# Altium project rNET_POE_Sensor.PrjPcb
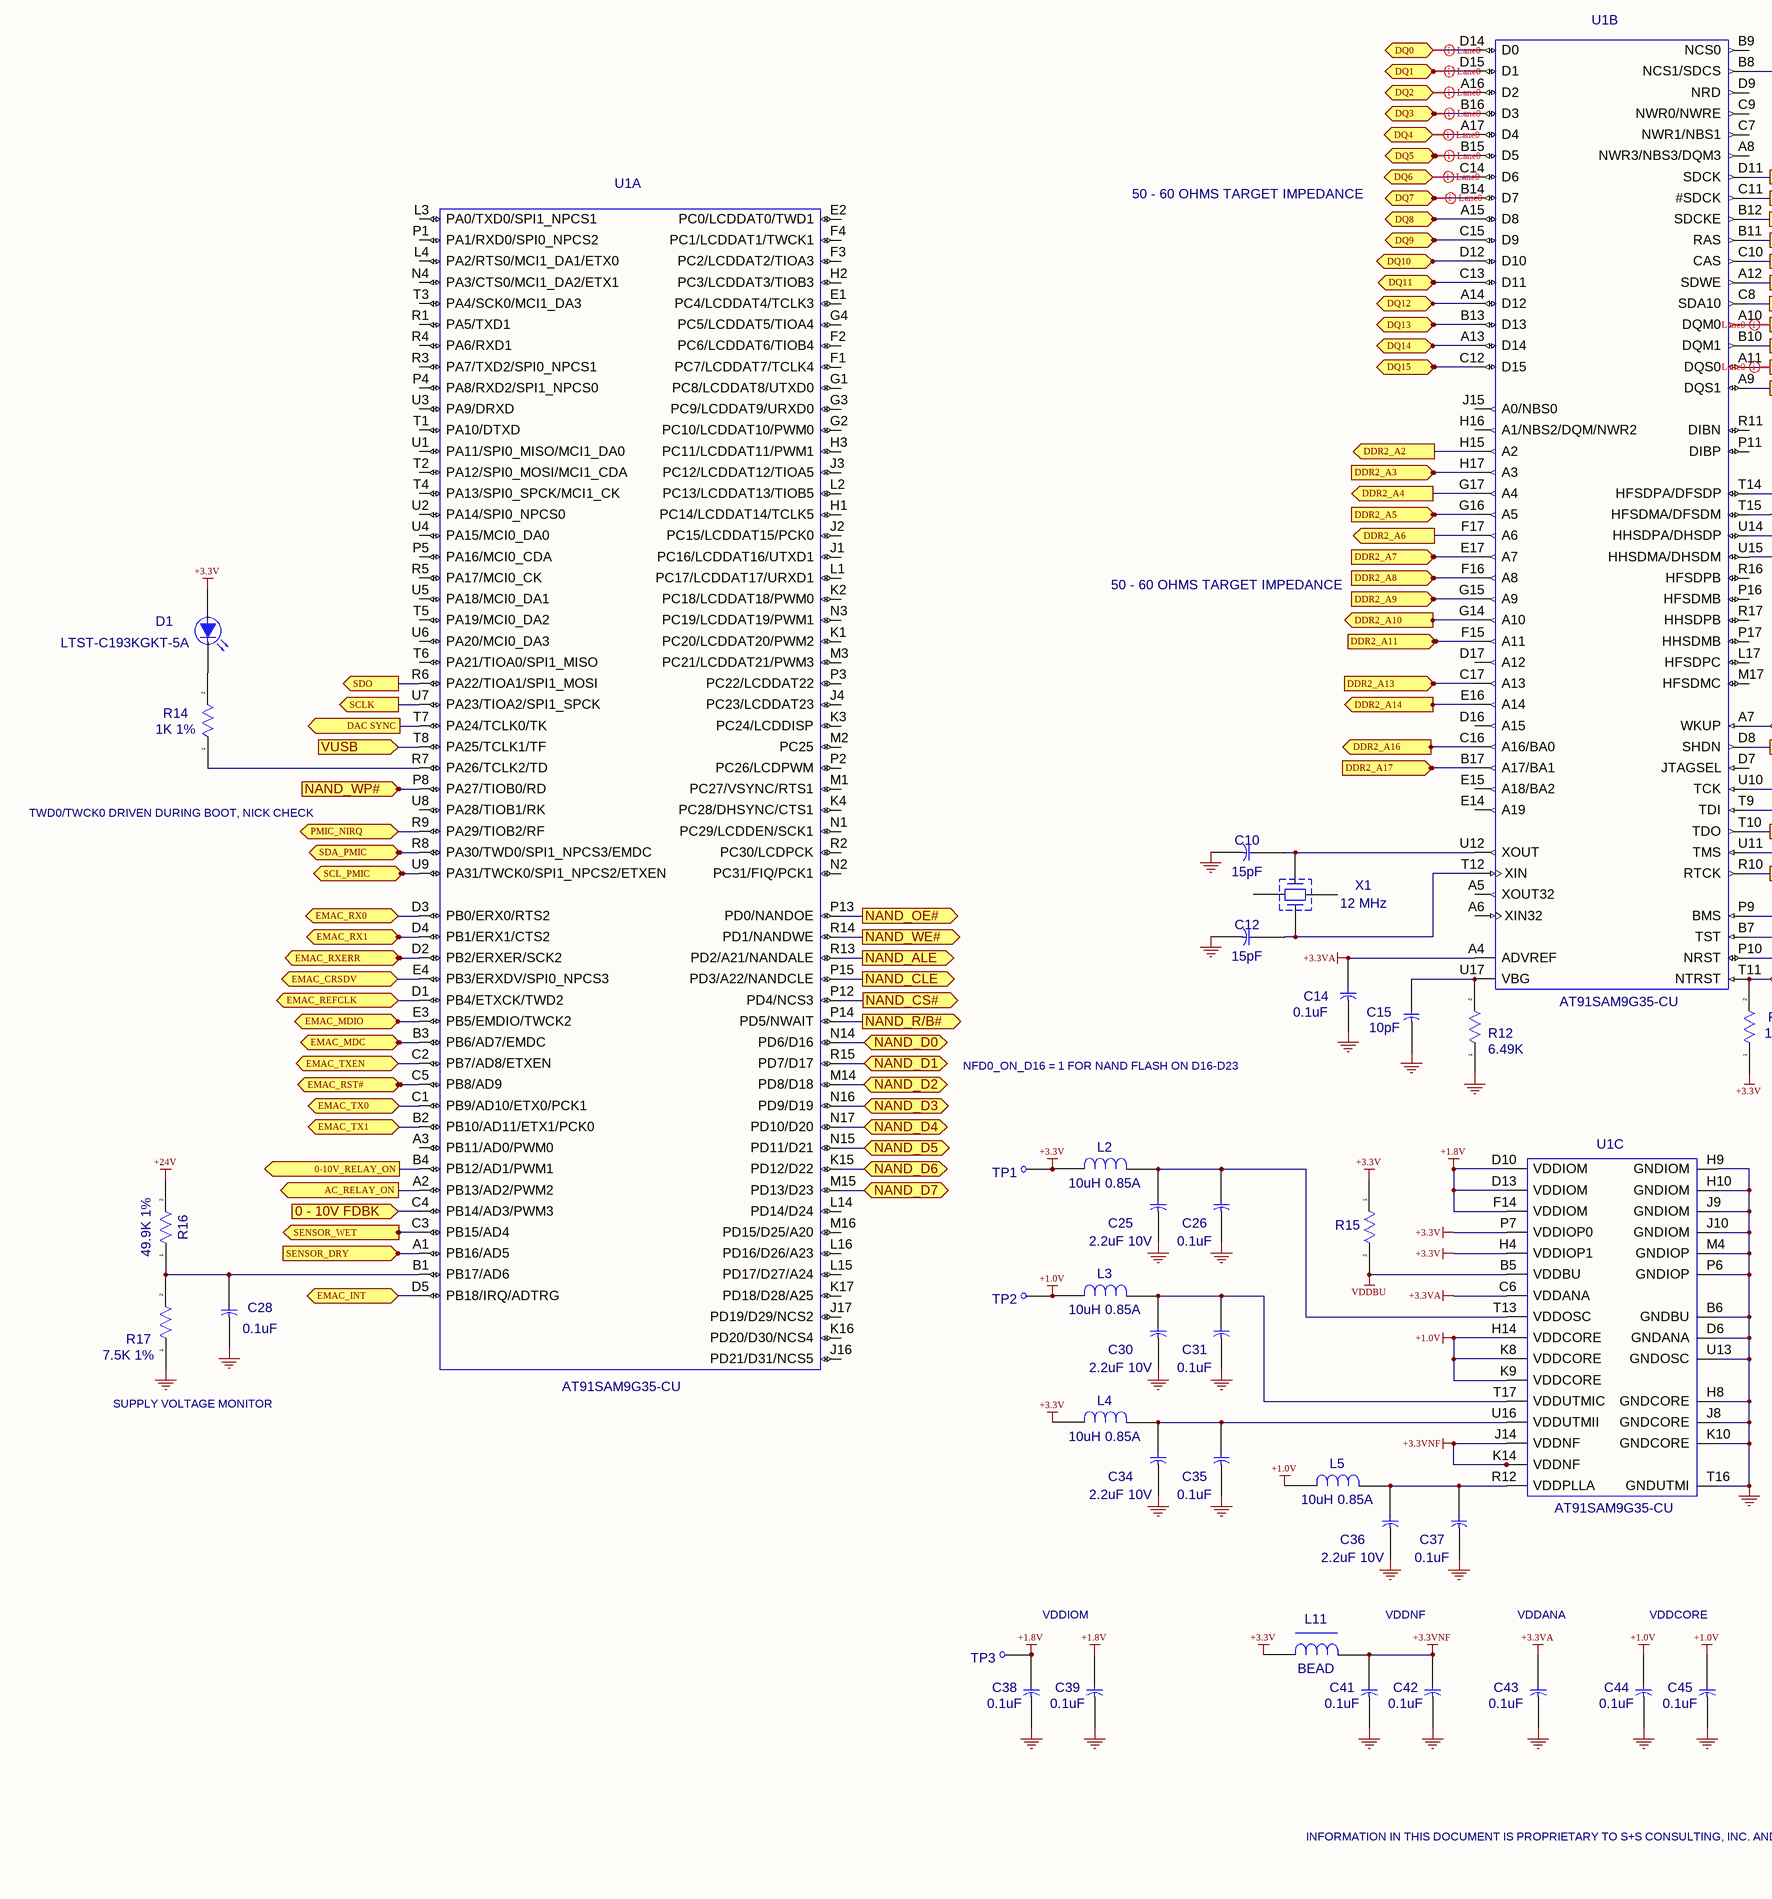
[diagram p0: rNET_POE_Sensor._Sheet1_RevA1.SchDoc, bottom left]
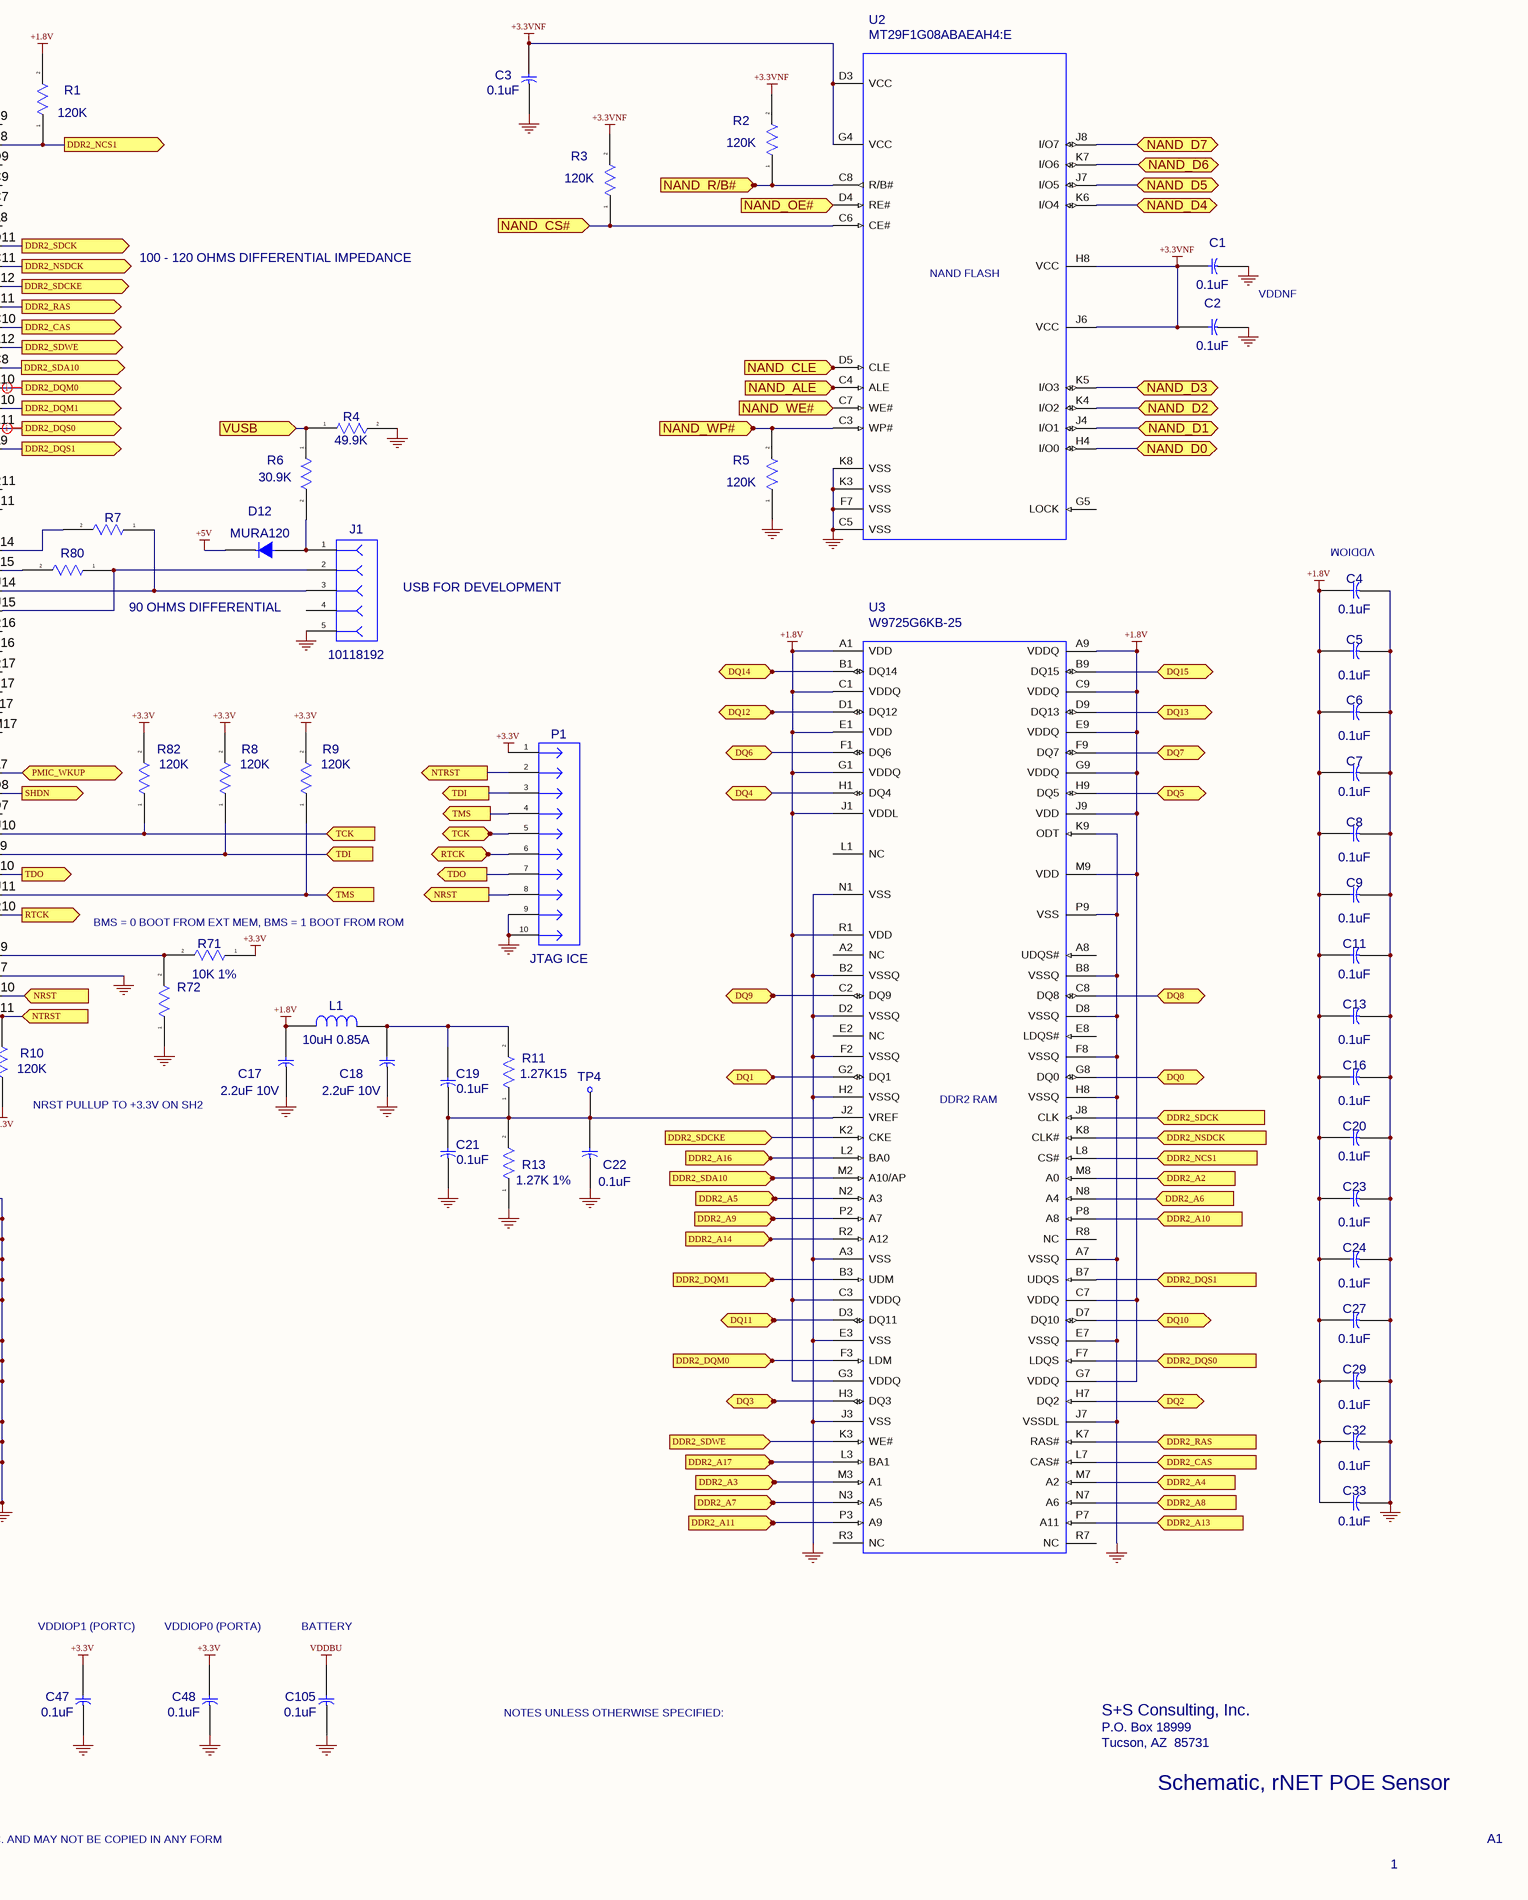
[diagram p1: rNET_POE_Sensor._Sheet1_RevA1.SchDoc, bottom right]
2 sheets, 269 parts. Net scope: global (net labels, ports and power ports of the same name join across sheets).
Board file: rNET_POE_Sensor_RevA1.PCBDOC
Sheets:
  rNET_POE_Sensor._Sheet1_RevA1.SchDoc
  rNET_POE_Sensor._Sheet2_RevA1.SchDoc

## Sheet rNET_POE_Sensor._Sheet1_RevA1.SchDoc: Sentinel Radio
size D; ApprovedBy: S. Fister; CompanyName: ECO Wireless; DrawnBy: SRF; Organization: Sentinel System, LLC; Address1: P.O. Box 18999; Address2: Tucson, AZ; Address3: 85731; Revision: X1; SheetNumber: 1; PageSetup: Record=PageOptions|CenterHorizontal=True|CenterVertical=True|PrintScale=0.52|XCorrection=1.00|YCorrection=1.00|PrintKind=0|BorderSize=5000000|LeftOffset=275|BottomOffset=0|Orientation=2|PaperLength=4318|PaperWidth=2794|Scale=100|PaperSource=7|PrintQuality=-3|MediaType=1|DitherType=10|PrintScaleMode=1|PaperKind=102 x 152 mm (4 x 6 in)|PaperIndex=158; ModifiedDate: Last Modified On

### Parts
C1  0.1uF  [0402NOM]
C2  0.1uF  [0402NOM]
C3  0.1uF  [0402NOM]
C4  0.1uF  [0402NOM]
C5  0.1uF  [0402NOM]
C6  0.1uF  [0402NOM]
C7  0.1uF  [0402NOM]
C8  0.1uF  [0402NOM]
C9  0.1uF  [0402NOM]
C10  15pF  [0402NOM]
C11  0.1uF  [0402NOM]
C12  15pF  [0402NOM]
C13  0.1uF  [0402NOM]
C14  0.1uF  [0402NOM]
C15  10pF  [0402NOM]
C16  0.1uF  [0402NOM]
C17  2.2uF 10V  [0402NOM]
C18  2.2uF 10V  [0402NOM]
C19  0.1uF  [0402NOM]
C20  0.1uF  [0402NOM]
C21  0.1uF  [0402NOM]
C22  0.1uF  [0402NOM]
C23  0.1uF  [0402NOM]
C24  0.1uF  [0402NOM]
C25  2.2uF 10V  [0402NOM]
C26  0.1uF  [0402NOM]
C27  0.1uF  [0402NOM]
C28  0.1uF  [0402NOM]
C29  0.1uF  [0402NOM]
C30  2.2uF 10V  [0402NOM]
C31  0.1uF  [0402NOM]
C32  0.1uF  [0402NOM]
C33  0.1uF  [0402NOM]
C34  2.2uF 10V  [0402NOM]
C35  0.1uF  [0402NOM]
C36  2.2uF 10V  [0402NOM]
C37  0.1uF  [0402NOM]
C38  0.1uF  [0402NOM]
C39  0.1uF  [0402NOM]
C41  0.1uF  [0402NOM]
C42  0.1uF  [0402NOM]
C43  0.1uF  [0402NOM]
C44  0.1uF  [0402NOM]
C45  0.1uF  [0402NOM]
C47  0.1uF  [0402NOM]
C48  0.1uF  [0402NOM]
C105  0.1uF  [0402NOM]
D1  LTST-C193KGKT-5A  [0603_POL]
D12  MURA120  [SMAPWR]
J1  10118192  [USB_MICROB_AMPHENOL_10118192-0001LF]
L1  10uH 0.85A  [1008]
L2  10uH 0.85A  [1008]
L3  10uH 0.85A  [1008]
L4  10uH 0.85A  [1008]
L5  10uH 0.85A  [1008]
L11  BEAD  [0402NOM]
P1  JTAG ICE  [HEADER2X5D50]
R1  120K  [0402NOM]
R2  120K  [0402NOM]
R3  120K  [0402NOM]
R4  49.9K  [0402NOM]
R5  120K  [0402NOM]
R6  30.9K  [0402NOM]
R7  39  [0402NOM]  (value not drawn)
R8  120K  [0402NOM]
R9  120K  [0402NOM]
R10  120K  [0402NOM]
R11  1.27K15  [0402NOM]
R12  6.49K  [0402NOM]
R13  1.27K 1%  [0402NOM]
R14  1K 1%  [0402NOM]
R15  0  [0402NOM]  (value not drawn)
R16  49.9K 1%  [0402NOM]
R17  7.5K 1%  [0402NOM]
R71  10K 1%  [0402NOM]
R72  49.9  [0402NOM]  (value not drawn)
R80  39  [0402NOM]  (value not drawn)
R82  120K  [0402NOM]
TP1  +3.3V  [TESTPOINTTOPD25]  (value not drawn)
TP2  +1.0V  [TESTPOINTTOPD25]  (value not drawn)
TP3  +1.8V  [TESTPOINTTOPD25]  (value not drawn)
TP4  VREF  [TESTPOINTTOPD25]  (value not drawn)
U1  AT91SAM9G35-CU  [BGA217_17x17]  (parts A,B,C of 3)
U2  MT29F1G08ABAEAH4:E  [VFBGA63]
U3  W9725G6KB-25  [WBGA84]
X1  12 MHz  [XTALABMM2]

### Ports
0 - 10V FDBK (in), 0-10V_RELAY_ON (out), AC_RELAY_ON (out), DAC SYNC (out), DDR2_A2 (in), DDR2_A2 (out), DDR2_A3 (in), DDR2_A3 (out), DDR2_A4 (in), DDR2_A4 (out), DDR2_A5 (in), DDR2_A5 (out), DDR2_A6 (in), DDR2_A6 (out), DDR2_A7 (in), DDR2_A7 (out), DDR2_A8 (in), DDR2_A8 (out), DDR2_A9 (in), DDR2_A9 (out), DDR2_A10 (in), DDR2_A10 (out), DDR2_A11 (in), DDR2_A11 (out), DDR2_A13 (in), DDR2_A13 (out), DDR2_A14 (in), DDR2_A14 (out), DDR2_A16 (in), DDR2_A16 (out), DDR2_A17 (in), DDR2_A17 (out), DDR2_CAS (in), DDR2_CAS (out), DDR2_DQM0 (in), DDR2_DQM0 (out), DDR2_DQM1 (in), DDR2_DQM1 (out), DDR2_DQS0 (in), DDR2_DQS0 (out), DDR2_DQS1 (in), DDR2_DQS1 (out), DDR2_NCS1 (in), DDR2_NCS1 (out), DDR2_NSDCK (in), DDR2_NSDCK (out), DDR2_RAS (in), DDR2_RAS (out), DDR2_SDA10 (in), DDR2_SDA10 (out), DDR2_SDCK (in), DDR2_SDCK (out), DDR2_SDCKE (in), DDR2_SDCKE (out), DDR2_SDWE (in), DDR2_SDWE (out), DQ0 (bidir), DQ1 (bidir), DQ2 (bidir), DQ3 (bidir), DQ4 (bidir), DQ5 (bidir), DQ6 (bidir), DQ7 (bidir), DQ8 (bidir), DQ9 (bidir), DQ10 (bidir), DQ11 (bidir), DQ12 (bidir), DQ13 (bidir), DQ14 (bidir), DQ15 (bidir), EMAC_CRSDV (bidir), EMAC_INT (bidir), EMAC_MDC (bidir), EMAC_MDIO (bidir), EMAC_REFCLK (bidir), EMAC_RST# (bidir), EMAC_RX0 (bidir), EMAC_RX1 (bidir), EMAC_RXERR (bidir), EMAC_TX0 (bidir), EMAC_TX1 (bidir), EMAC_TXEN (bidir), NAND_ALE (in), NAND_ALE (out), NAND_CLE (in), NAND_CLE (out), NAND_CS# (in), NAND_CS# (out), NAND_D0 (bidir), NAND_D1 (bidir), NAND_D2 (bidir), NAND_D3 (bidir), NAND_D4 (bidir), NAND_D5 (bidir), NAND_D6 (bidir), NAND_D7 (bidir), NAND_OE# (in), NAND_OE# (out), NAND_R/B# (in), NAND_R/B# (out), NAND_WE# (in), NAND_WE# (out), NAND_WP# (in), NAND_WP# (out), NRST (in), NRST (out), NTRST (in), NTRST (out), PMIC_NIRQ (bidir), PMIC_WKUP (bidir), RTCK (in), RTCK (out), SCL_PMIC (bidir), SCLK (out), SDA_PMIC (bidir), SDO (out), SENSOR_DRY (in), SENSOR_WET (in), SHDN (out), TCK (in), TCK (out), TDI (in), TDI (out), TDO (out), TMS (in), TMS (out), VUSB

### Nets
+1.0V: C44.2 C45.2 L3.2 L5.2 TP2.1 U1.H14(VDDCORE) U1.K8(VDDCORE) U1.K9(VDDCORE)
+1.8V: C4.2 C5.2 C6.2 C7.2 C8.2 C9.2 C11.2 C13.2 C16.2 C17.2 C20.2 C23.2 C24.2 C27.2 C29.2 C32.2 C33.2 C38.2 C39.2 L1.2 R1.2 TP3.1 U1.D10(VDDIOM) U1.D13(VDDIOM) U1.F14(VDDIOM) U3.A1(VDD) U3.A9(VDDQ) U3.C1(VDDQ) U3.C3(VDDQ) U3.C7(VDDQ) U3.C9(VDDQ) U3.E1(VDD) U3.E9(VDDQ) U3.G1(VDDQ) U3.G3(VDDQ) U3.G7(VDDQ) U3.G9(VDDQ) U3.J1(VDDL) U3.J9(VDD) U3.M9(VDD) U3.R1(VDD)
+3.3V: C47.2 C48.2 D1.2(A) L2.2 L4.2 L11.2 P1.1 R8.2 R9.2 R10.1 R15.1 R71.1 R82.2 TP1.1 U1.H4(VDDIOP1) U1.P7(VDDIOP0)
+3.3VA: C14.2 C43.2 U1.A4(ADVREF) U1.C6(VDDANA)
+3.3VNF: C1.2 C2.2 C3.2 C41.2 C42.2 L11.1 R2.2 R3.2 U1.J14(VDDNF) U1.K14(VDDNF) U2.D3(VCC) U2.G4(VCC) U2.H8(VCC) U2.J6(VCC)
+5V: D12.2(C)
+24V: R16.2
GND: C1.1 C2.1 C3.1 C4.1 C5.1 C6.1 C7.1 C8.1 C9.1 C10.1 C11.1 C12.1 C13.1 C14.1 C15.1 C16.1 C17.1 C18.1 C20.1 C21.1 C22.1 C23.1 C24.1 C25.1 C26.1 C27.1 C28.1 C29.1 C30.1 C31.1 C32.1 C33.1 C34.1 C35.1 C36.1 C37.1 C38.1 C39.1 C41.1 C42.1 C43.1 C44.1 C45.1 C47.1 C48.1 C105.1 J1.5 P1.9 P1.10 R4.2 R5.1 R12.1 R13.1 R17.1 R72.1 U1.B6(GNDBU) U1.B7(TST) U1.D6(GNDANA) U1.H8(GNDCORE) U1.H9(GNDIOM) U1.H10(GNDIOM) U1.J8(GNDCORE) U1.J9(GNDIOM) U1.J10(GNDIOM) U1.K10(GNDCORE) U1.M4(GNDIOP) U1.P6(GNDIOP) U1.T16(GNDUTMI) U1.U13(GNDOSC) U2.C5(VSS) U2.F7(VSS) U2.K3(VSS) U2.K8(VSS) U3.A3(VSS) U3.A7(VSSQ) U3.B2(VSSQ) U3.B8(VSSQ) U3.D2(VSSQ) U3.D8(VSSQ) U3.E3(VSS) U3.E7(VSSQ) U3.F2(VSSQ) U3.F8(VSSQ) U3.H2(VSSQ) U3.H8(VSSQ) U3.J3(VSS) U3.J7(VSSDL) U3.K9(ODT) U3.N1(VSS) U3.P9(VSS)
VDDBU: C105.2 R15.2 U1.B5(VDDBU)
0 - 10V FDBK: U1.C4(PB14/AD3/PWM3) ; port 0 - 10V FDBK
0-10V_RELAY_ON: U1.B4(PB12/AD1/PWM1) ; port 0-10V_RELAY_ON
AC_RELAY_ON: U1.A2(PB13/AD2/PWM2) ; port AC_RELAY_ON
DAC SYNC: U1.T7(PA24/TCLK0/TK) ; port DAC SYNC
DDR2_A2: U1.H15(A2) U3.M8(A0) ; port DDR2_A2
DDR2_A3: U1.H17(A3) U3.M3(A1) ; port DDR2_A3
DDR2_A4: U1.G17(A4) U3.M7(A2) ; port DDR2_A4
DDR2_A5: U1.G16(A5) U3.N2(A3) ; port DDR2_A5
DDR2_A6: U1.F17(A6) U3.N8(A4) ; port DDR2_A6
DDR2_A7: U1.E17(A7) U3.N3(A5) ; port DDR2_A7
DDR2_A8: U1.F16(A8) U3.N7(A6) ; port DDR2_A8
DDR2_A9: U1.G15(A9) U3.P2(A7) ; port DDR2_A9
DDR2_A10: U1.G14(A10) U3.P8(A8) ; port DDR2_A10
DDR2_A11: U1.F15(A11) U3.P3(A9) ; port DDR2_A11
DDR2_A13: U1.C17(A13) U3.P7(A11) ; port DDR2_A13
DDR2_A14: U1.E16(A14) U3.R2(A12) ; port DDR2_A14
DDR2_A16: U1.C16(A16/BA0) U3.L2(BA0) ; port DDR2_A16
DDR2_A17: U1.B17(A17/BA1) U3.L3(BA1) ; port DDR2_A17
DDR2_CAS: U1.C10(CAS) U3.L7(CAS#) ; port DDR2_CAS
DDR2_DQM0: U1.A10(DQM0) U3.F3(LDM) ; port DDR2_DQM0
DDR2_DQM1: U1.B10(DQM1) U3.B3(UDM) ; port DDR2_DQM1
DDR2_DQS0: U1.A11(DQS0) U3.F7(LDQS) ; port DDR2_DQS0
DDR2_DQS1: U1.A9(DQS1) U3.B7(UDQS) ; port DDR2_DQS1
DDR2_NCS1: R1.1 U1.B8(NCS1/SDCS) U3.L8(CS#) ; port DDR2_NCS1
DDR2_NSDCK: U1.C11(#SDCK) U3.K8(CLK#) ; port DDR2_NSDCK
DDR2_RAS: U1.B11(RAS) U3.K7(RAS#) ; port DDR2_RAS
DDR2_SDA10: U1.C8(SDA10) U3.M2(A10/AP) ; port DDR2_SDA10
DDR2_SDCK: U1.D11(SDCK) U3.J8(CLK) ; port DDR2_SDCK
DDR2_SDCKE: U1.B12(SDCKE) U3.K2(CKE) ; port DDR2_SDCKE
DDR2_SDWE: U1.A12(SDWE) U3.K3(WE#) ; port DDR2_SDWE
DQ0: U1.D14(D0) U3.G8(DQ0) ; port DQ0
DQ1: U1.D15(D1) U3.G2(DQ1) ; port DQ1
DQ2: U1.A16(D2) U3.H7(DQ2) ; port DQ2
DQ3: U1.B16(D3) U3.H3(DQ3) ; port DQ3
DQ4: U1.A17(D4) U3.H1(DQ4) ; port DQ4
DQ5: U1.B15(D5) U3.H9(DQ5) ; port DQ5
DQ6: U1.C14(D6) U3.F1(DQ6) ; port DQ6
DQ7: U1.B14(D7) U3.F9(DQ7) ; port DQ7
DQ8: U1.A15(D8) U3.C8(DQ8) ; port DQ8
DQ9: U1.C15(D9) U3.C2(DQ9) ; port DQ9
DQ10: U1.D12(D10) U3.D7(DQ10) ; port DQ10
DQ11: U1.C13(D11) U3.D3(DQ11) ; port DQ11
DQ12: U1.A14(D12) U3.D1(DQ12) ; port DQ12
DQ13: U1.B13(D13) U3.D9(DQ13) ; port DQ13
DQ14: U1.A13(D14) U3.B1(DQ14) ; port DQ14
DQ15: U1.C12(D15) U3.B9(DQ15) ; port DQ15
EMAC_CRSDV: U1.E4(PB3/ERXDV/SPI0_NPCS3) ; port EMAC_CRSDV
EMAC_INT: U1.D5(PB18/IRQ/ADTRG) ; port EMAC_INT
EMAC_MDC: U1.B3(PB6/AD7/EMDC) ; port EMAC_MDC
EMAC_MDIO: U1.E3(PB5/EMDIO/TWCK2) ; port EMAC_MDIO
EMAC_REFCLK: U1.D1(PB4/ETXCK/TWD2) ; port EMAC_REFCLK
EMAC_RST#: U1.C5(PB8/AD9) ; port EMAC_RST#
EMAC_RX0: U1.D3(PB0/ERX0/RTS2) ; port EMAC_RX0
EMAC_RX1: U1.D4(PB1/ERX1/CTS2) ; port EMAC_RX1
EMAC_RXERR: U1.D2(PB2/ERXER/SCK2) ; port EMAC_RXERR
EMAC_TX0: U1.C1(PB9/AD10/ETX0/PCK1) ; port EMAC_TX0
EMAC_TX1: U1.B2(PB10/AD11/ETX1/PCK0) ; port EMAC_TX1
EMAC_TXEN: U1.C2(PB7/AD8/ETXEN) ; port EMAC_TXEN
NAND_ALE: U1.R13(PD2/A21/NANDALE) U2.C4(ALE) ; port NAND_ALE
NAND_CLE: U1.P15(PD3/A22/NANDCLE) U2.D5(CLE) ; port NAND_CLE
NAND_CS#: R3.1 U1.P12(PD4/NCS3) U2.C6(CE#) ; port NAND_CS#
NAND_D0: U1.N14(PD6/D16) U2.H4(I/O0) ; port NAND_D0
NAND_D1: U1.R15(PD7/D17) U2.J4(I/O1) ; port NAND_D1
NAND_D2: U1.M14(PD8/D18) U2.K4(I/O2) ; port NAND_D2
NAND_D3: U1.N16(PD9/D19) U2.K5(I/O3) ; port NAND_D3
NAND_D4: U1.N17(PD10/D20) U2.K6(I/O4) ; port NAND_D4
NAND_D5: U1.N15(PD11/D21) U2.J7(I/O5) ; port NAND_D5
NAND_D6: U1.K15(PD12/D22) U2.K7(I/O6) ; port NAND_D6
NAND_D7: U1.M15(PD13/D23) U2.J8(I/O7) ; port NAND_D7
NAND_OE#: U1.P13(PD0/NANDOE) U2.D4(RE#) ; port NAND_OE#
NAND_R/B#: R2.1 U1.P14(PD5/NWAIT) U2.C8(R/B#) ; port NAND_R/B#
NAND_WE#: U1.R14(PD1/NANDWE) U2.C7(WE#) ; port NAND_WE#
NAND_WP#: R5.2 U1.P8(PA27/TIOB0/RD) U2.C3(WP#) ; port NAND_WP#
NRST: P1.8 U1.P10(NRST) ; port NRST
NTRST: P1.2 R10.2 U1.T11(NTRST) ; port NTRST
PMIC_NIRQ: U1.R9(PA29/TIOB2/RF) ; port PMIC_NIRQ
PMIC_WKUP: U1.A7(WKUP) ; port PMIC_WKUP
RTCK: P1.6 U1.R10(RTCK) ; port RTCK
SCL_PMIC: U1.U9(PA31/TWCK0/SPI1_NPCS2/ETXEN) ; port SCL_PMIC
SCLK: U1.U7(PA23/TIOA2/SPI1_SPCK) ; port SCLK
SDA_PMIC: U1.R8(PA30/TWD0/SPI1_NPCS3/EMDC) ; port SDA_PMIC
SDO: U1.R6(PA22/TIOA1/SPI1_MOSI) ; port SDO
SENSOR_DRY: U1.A1(PB16/AD5) ; port SENSOR_DRY
SENSOR_WET: U1.C3(PB15/AD4) ; port SENSOR_WET
SHDN: U1.D8(SHDN) ; port SHDN
TCK: P1.5 R82.1 U1.U10(TCK) ; port TCK
TDI: P1.3 R8.1 U1.T9(TDI) ; port TDI
TDO: P1.7 U1.T10(TDO) ; port TDO
TMS: P1.4 R9.1 U1.U11(TMS) ; port TMS
VUSB: R4.1 R6.1 U1.T8(PA25/TCLK1/TF) ; port VUSB
NetC10_2: C10.2 U1.U12(XOUT) X1.1
NetC12_2: C12.2 U1.T12(XIN) X1.3
NetC15_2: C15.2 R12.2 U1.U17(VBG)
NetC18_2: C18.2 C19.2 L1.1 R11.2
NetC19_1: C19.1 C21.2 C22.2 R11.1 R13.2 TP4.1 U3.J2(VREF)
NetC25_2: C25.2 C26.2 L2.1 U1.T13(VDDOSC)
NetC28_2: C28.2 R16.1 R17.2 U1.B1(PB17/AD6)
NetC30_2: C30.2 C31.2 L3.1 U1.T17(VDDUTMIC)
NetC34_2: C34.2 C35.2 L4.1 U1.U16(VDDUTMII)
NetC36_2: C36.2 C37.2 L5.1 U1.R12(VDDPLLA)
NetD1_1: D1.1(C) R14.2
NetD12_1: D12.1(A) J1.1 R6.2
NetJ1_2: J1.2 R80.1 U1.U15(HHSDMA/DHSDM)
NetJ1_3: J1.3 R7.1 U1.U14(HHSDPA/DHSDP)
NetR7_2: R7.2 U1.T14(HFSDPA/DFSDP)
NetR14_1: R14.1 U1.R7(PA26/TCLK2/TD)
NetR71_2: R71.2 R72.2 U1.P9(BMS)
NetR80_2: R80.2 U1.T15(HFSDMA/DFSDM)

Not connected (* = marked no-connect by the designer): J1 4 9 10 11 12; U1 A3(PB11/AD0/PWM0) A5(XOUT32) A6(XIN32) A8(NWR3/NBS3/DQM3) B9(NCS0) C7(NWR1/NBS1) C9(NWR0/NWRE) D7(JTAGSEL) D9(NRD) D16(A15) D17(A12) E1(PC4/LCDDAT4/TCLK3) E2(PC0/LCDDAT0/TWD1) E14(A19) E15(A18/BA2) F1(PC7/LCDDAT7/TCLK4) F2(PC6/LCDDAT6/TIOB4) F3(PC2/LCDDAT2/TIOA3) F4(PC1/LCDDAT1/TWCK1) G1(PC8/LCDDAT8/UTXD0) G2(PC10/LCDDAT10/PWM0) G3(PC9/LCDDAT9/URXD0) G4(PC5/LCDDAT5/TIOA4) H1(PC14/LCDDAT14/TCLK5) H2(PC3/LCDDAT3/TIOB3) H3(PC11/LCDDAT11/PWM1) H16(A1/NBS2/DQM/NWR2) J1(PC16/LCDDAT16/UTXD1) J2(PC15/LCDDAT15/PCK0) J3(PC12/LCDDAT12/TIOA5) J4(PC23/LCDDAT23) J15(A0/NBS0) J16(PD21/D31/NCS5) J17(PD19/D29/NCS2) K1(PC20/LCDDAT20/PWM2) K2(PC18/LCDDAT18/PWM0) K3(PC24/LCDDISP) K4(PC28/DHSYNC/CTS1) K16(PD20/D30/NCS4) K17(PD18/D28/A25) L1(PC17/LCDDAT17/URXD1) L2(PC13/LCDDAT13/TIOB5) L3(PA0/TXD0/SPI1_NPCS1) L4(PA2/RTS0/MCI1_DA1/ETX0) L14(PD14/D24) L15(PD17/D27/A24) L16(PD16/D26/A23) L17(HFSDPC) M1(PC27/VSYNC/RTS1) M2(PC25) M3(PC21/LCDDAT21/PWM3) M16(PD15/D25/A20) M17(HFSDMC) N1(PC29/LCDDEN/SCK1) N2(PC31/FIQ/PCK1) N3(PC19/LCDDAT19/PWM1) N4(PA3/CTS0/MCI1_DA2/ETX1) P1(PA1/RXD0/SPI0_NPCS2) P2(PC26/LCDPWM) P3(PC22/LCDDAT22) P4(PA8/RXD2/SPI1_NPCS0) P5(PA16/MCI0_CDA) P11(DIBP) P16(HFSDMB) P17(HHSDMB) R1(PA5/TXD1) R2(PC30/LCDPCK) R3(PA7/TXD2/SPI0_NPCS1) R4(PA6/RXD1) R5(PA17/MCI0_CK) R11(DIBN) R16(HFSDPB) R17(HHSDPB) T1(PA10/DTXD) T2(PA12/SPI0_MOSI/MCI1_CDA) T3(PA4/SCK0/MCI1_DA3) T4(PA13/SPI0_SPCK/MCI1_CK) T5(PA19/MCI0_DA2) T6(PA21/TIOA0/SPI1_MISO) U1(PA11/SPI0_MISO/MCI1_DA0) U2(PA14/SPI0_NPCS0) U3(PA9/DRXD) U4(PA15/MCI0_DA0) U5(PA18/MCI0_DA1) U6(PA20/MCI0_DA3) U8(PA28/TIOB1/RK); U2 G5(LOCK); U3 A2(NC) A8(UDQS#) E2(NC) E8(LDQS#) L1(NC) R3(NC) R7(NC) R8(NC); X1 2 4

### Layout directives
net class Undefined: DDR2_DQM0, DDR2_DQS0, DQ0, DQ1, DQ2, DQ3, DQ4, DQ5, DQ6, DQ7

### Notes on the sheet
- 50 - 60 OHMS TARGET IMPEDANCE
- 100 - 120 OHMS DIFFERENTIAL IMPEDANCE
- (near U2) NAND FLASH
- VDDNF
- (near C4) VDDIOM
- 90 OHMS DIFFERENTIAL
- USB FOR DEVELOPMENT
- TWD0/TWCK0 DRIVEN DURING BOOT, NICK CHECK
- (near R71) BMS = 0 BOOT FROM EXT MEM, BMS = 1 BOOT FROM ROM
- NFD0_ON_D16 = 1 FOR NAND FLASH ON D16-D23
- (near R10) NRST PULLUP TO +3.3V ON SH2
- (near U3) DDR2 RAM
- SUPPLY VOLTAGE MONITOR
- VDDIOM
- VDDANA
- VDDCORE
- VDDIOP1 (PORTC)
- VDDIOP0 (PORTA)
- BATTERY
- NOTES UNLESS OTHERWISE SPECIFIED:
- S+S Consulting, Inc.
- P.O. Box 18999
- Tucson, AZ  85731
- Schematic, rNET POE Sensor
- INFORMATION IN THIS DOCUMENT IS PROPRIETARY TO S+S CONSULTING, INC. AND MAY NOT BE COPIED IN ANY FORM
- 1
- A1

### Library data of the parts
C1-C39 C41-C45 C47 C48 C105 = CCAP0402: Value: {Value}; Part Number: CCAP0402
D1 = LED_0603_C1A2: Value: {Value}; Part Number: LED_0603_C1A2
D12 = DIODESMAPWR: Value: {Value}; Part Number: DIODESMAPWR
J1 = USB_MICROB_AMPHENOL_10118192-0001LF: Value: {Value}; Part Number: USB_MICROB_AMPHENOL_10118192-0001LF
L1-L5 = IND1008: Value: {Value}; Part Number: IND1008
L11 = FERRITE0402: Value: {Value}; Part Number: FERRITE0402
P1 = HEADER2X5D50: Part Number: HEADER2X5D50; Value: *
R1-R17 R71 R72 R80 R82 = RRES0402: Value: {Value}; Part Number: RRES0402
TP1-TP4 = TESTPOINTTOPD25: Part Number: TESTPOINTTOPD25; Value: *
X1 = XTALABMM2: Value: {Value}; Part Number: XTALABMM2
U1 = AT91SAM9G35-CU: DatasheetVersion: revB, Sep-2011; PackageVersion: 2011; PackageReference: LFBGA217; PackageDescription: 217-Ball Plastic Low Profile Fine-Pitch BGA, 15 x 15 mm Body, 0.8 mm Pitch; Code_JEDEC: MO-205; ComponentLink1Description: Manufacturer URL; ComponentLink1URL: http://www.atmel.com/; ComponentLink2Description: SAM9G35 Datasheet; ComponentLink2URL: http://www.atmel.com/dyn/resources/prod_documents/doc11053.pdf; ComponentLink3Description: SAM9G35 Summary; ComponentLink3URL: http://www.atmel.com/dyn/resources/prod_documents/11053s.pdf; Part Number: AT91SAM9G35-CU; Value: *
U2 = MT29F1G08ABAEAH4:E: Part Number: MT29F1G08ABAEAH4:E; Value: *
U3 = W9725G6KB-25: Part Number: W9725G6KB-25; Value: *

## Sheet rNET_POE_Sensor._Sheet2_RevA1.SchDoc
size D; Organization: Altium Limited; Address1: L3, 12a Rodborough Rd; Address2: Frenchs Forest; Address3: NSW; Address4: Australia 2086; SheetNumber: 2; PageSetup: Record=PageOptions|CenterHorizontal=True|CenterVertical=True|PrintScale=0.52|XCorrection=1.00|YCorrection=1.00|PrintKind=0|BorderSize=5000000|LeftOffset=0|BottomOffset=0|Orientation=2|PaperLength=4318|PaperWidth=2794|Scale=100|PaperSource=7|PrintQuality=-4|MediaType=1|DitherType=10|PrintScaleMode=1|PaperKind=Ledger (11 x 17 in)|PaperIndex=3
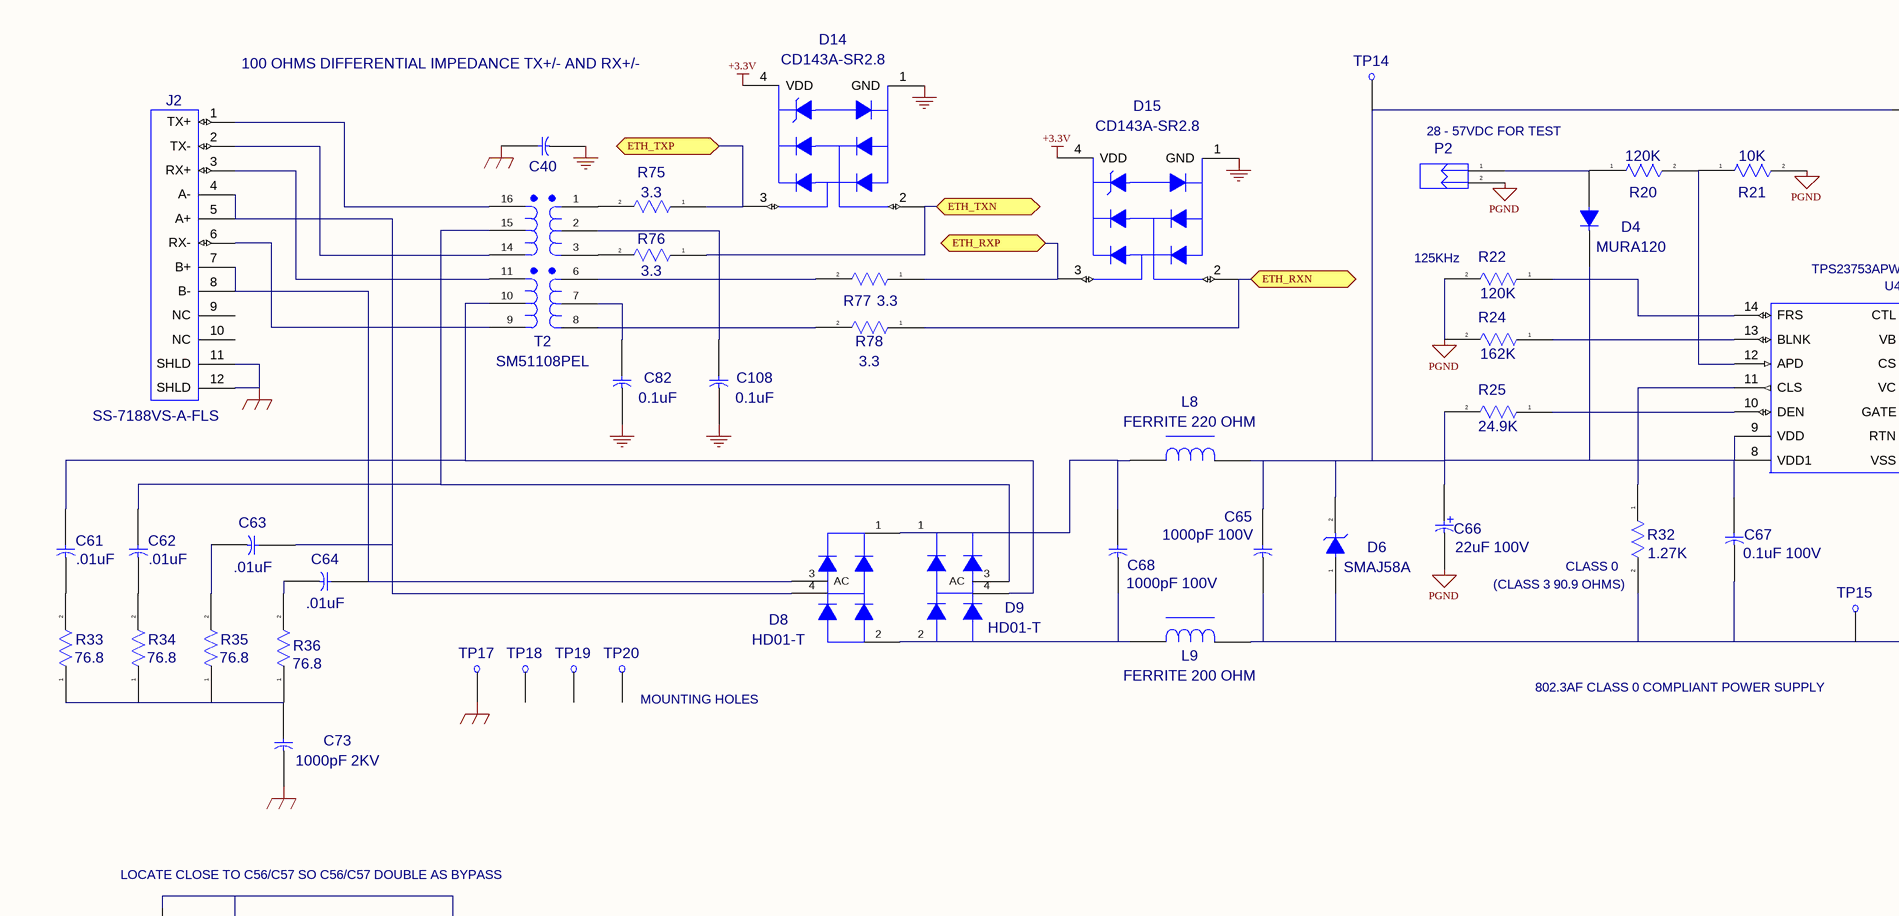
[diagram p2: rNET_POE_Sensor._Sheet2_RevA1.SchDoc, top left]
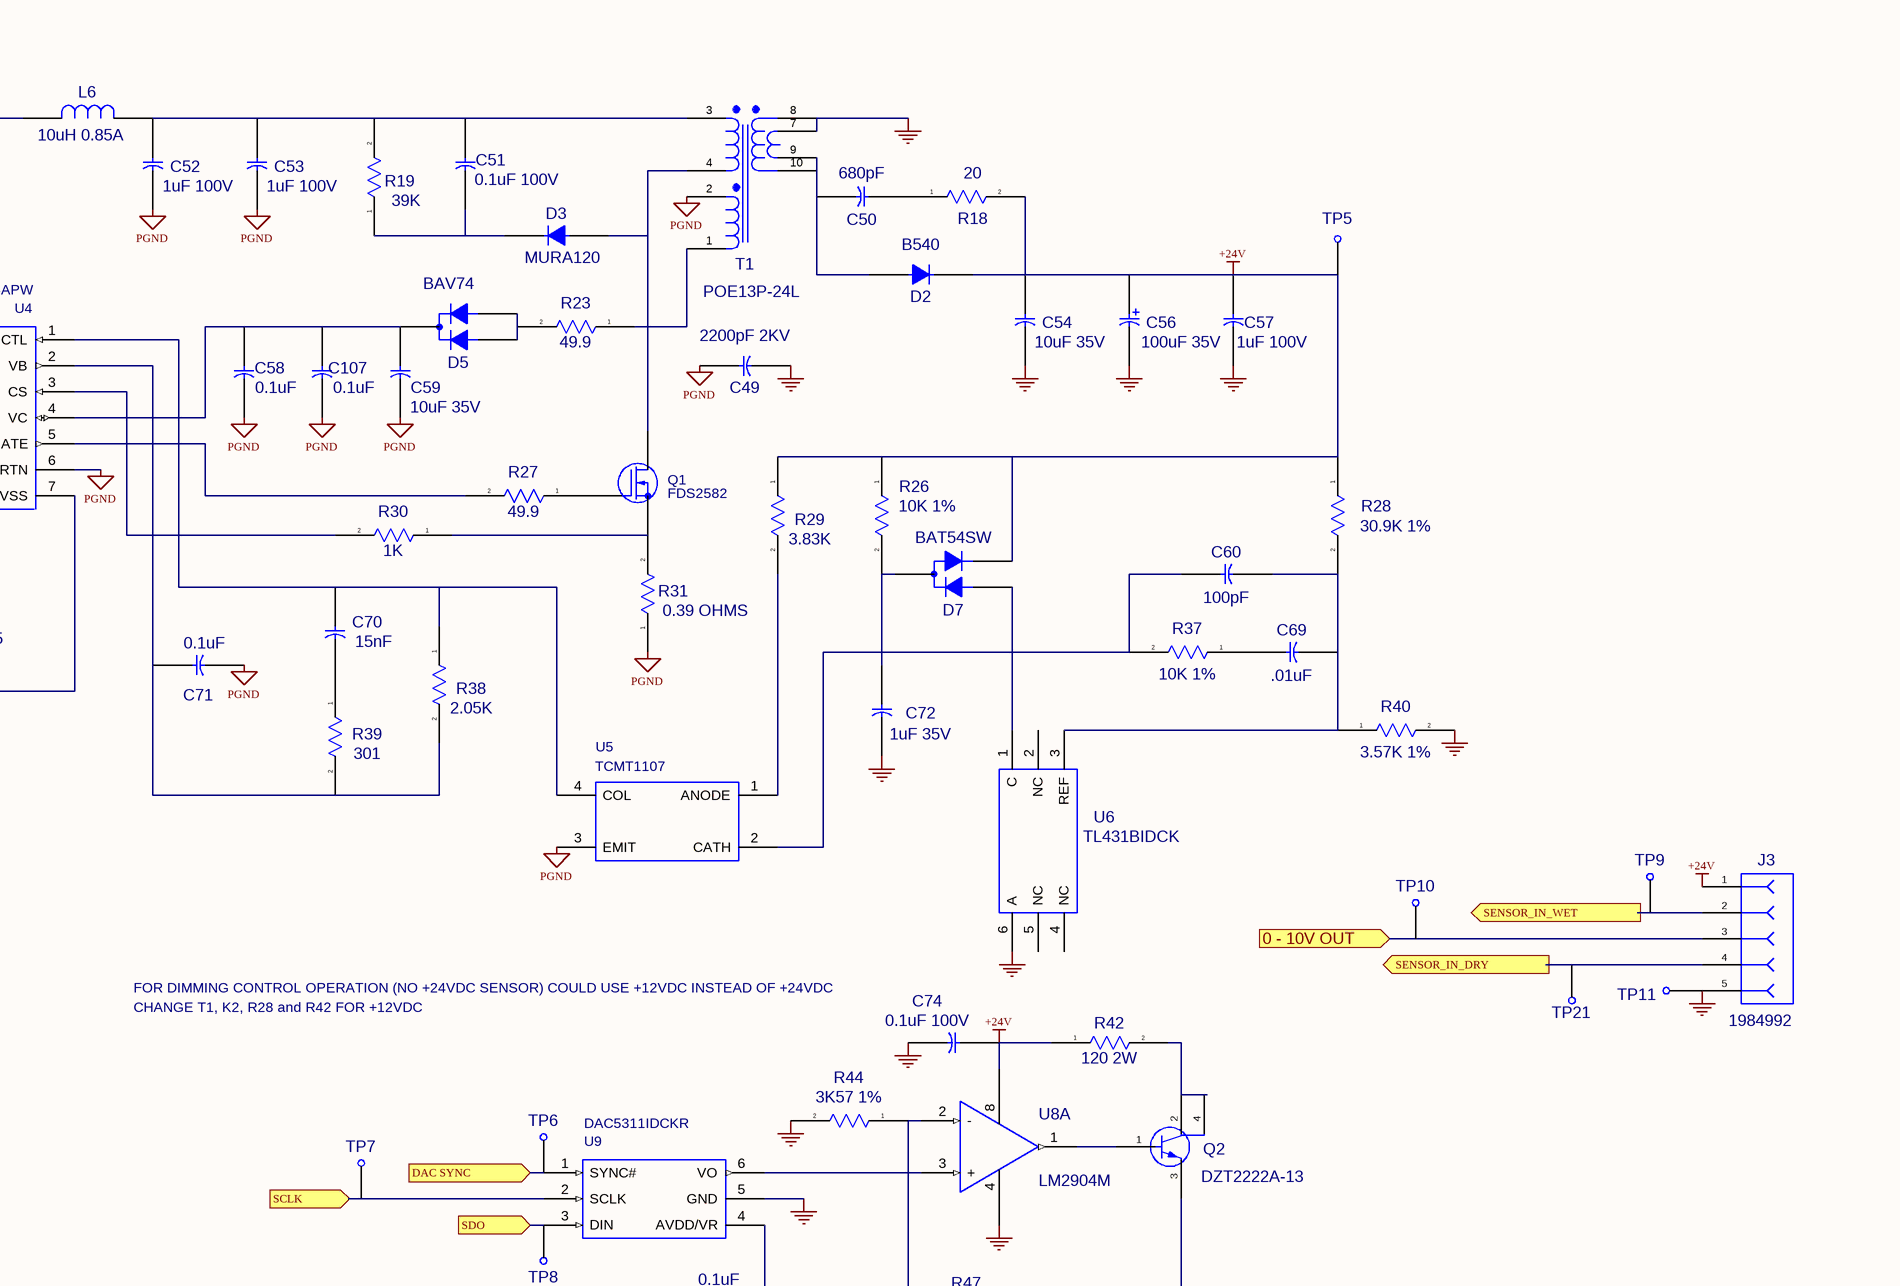
[diagram p3: rNET_POE_Sensor._Sheet2_RevA1.SchDoc, top right]
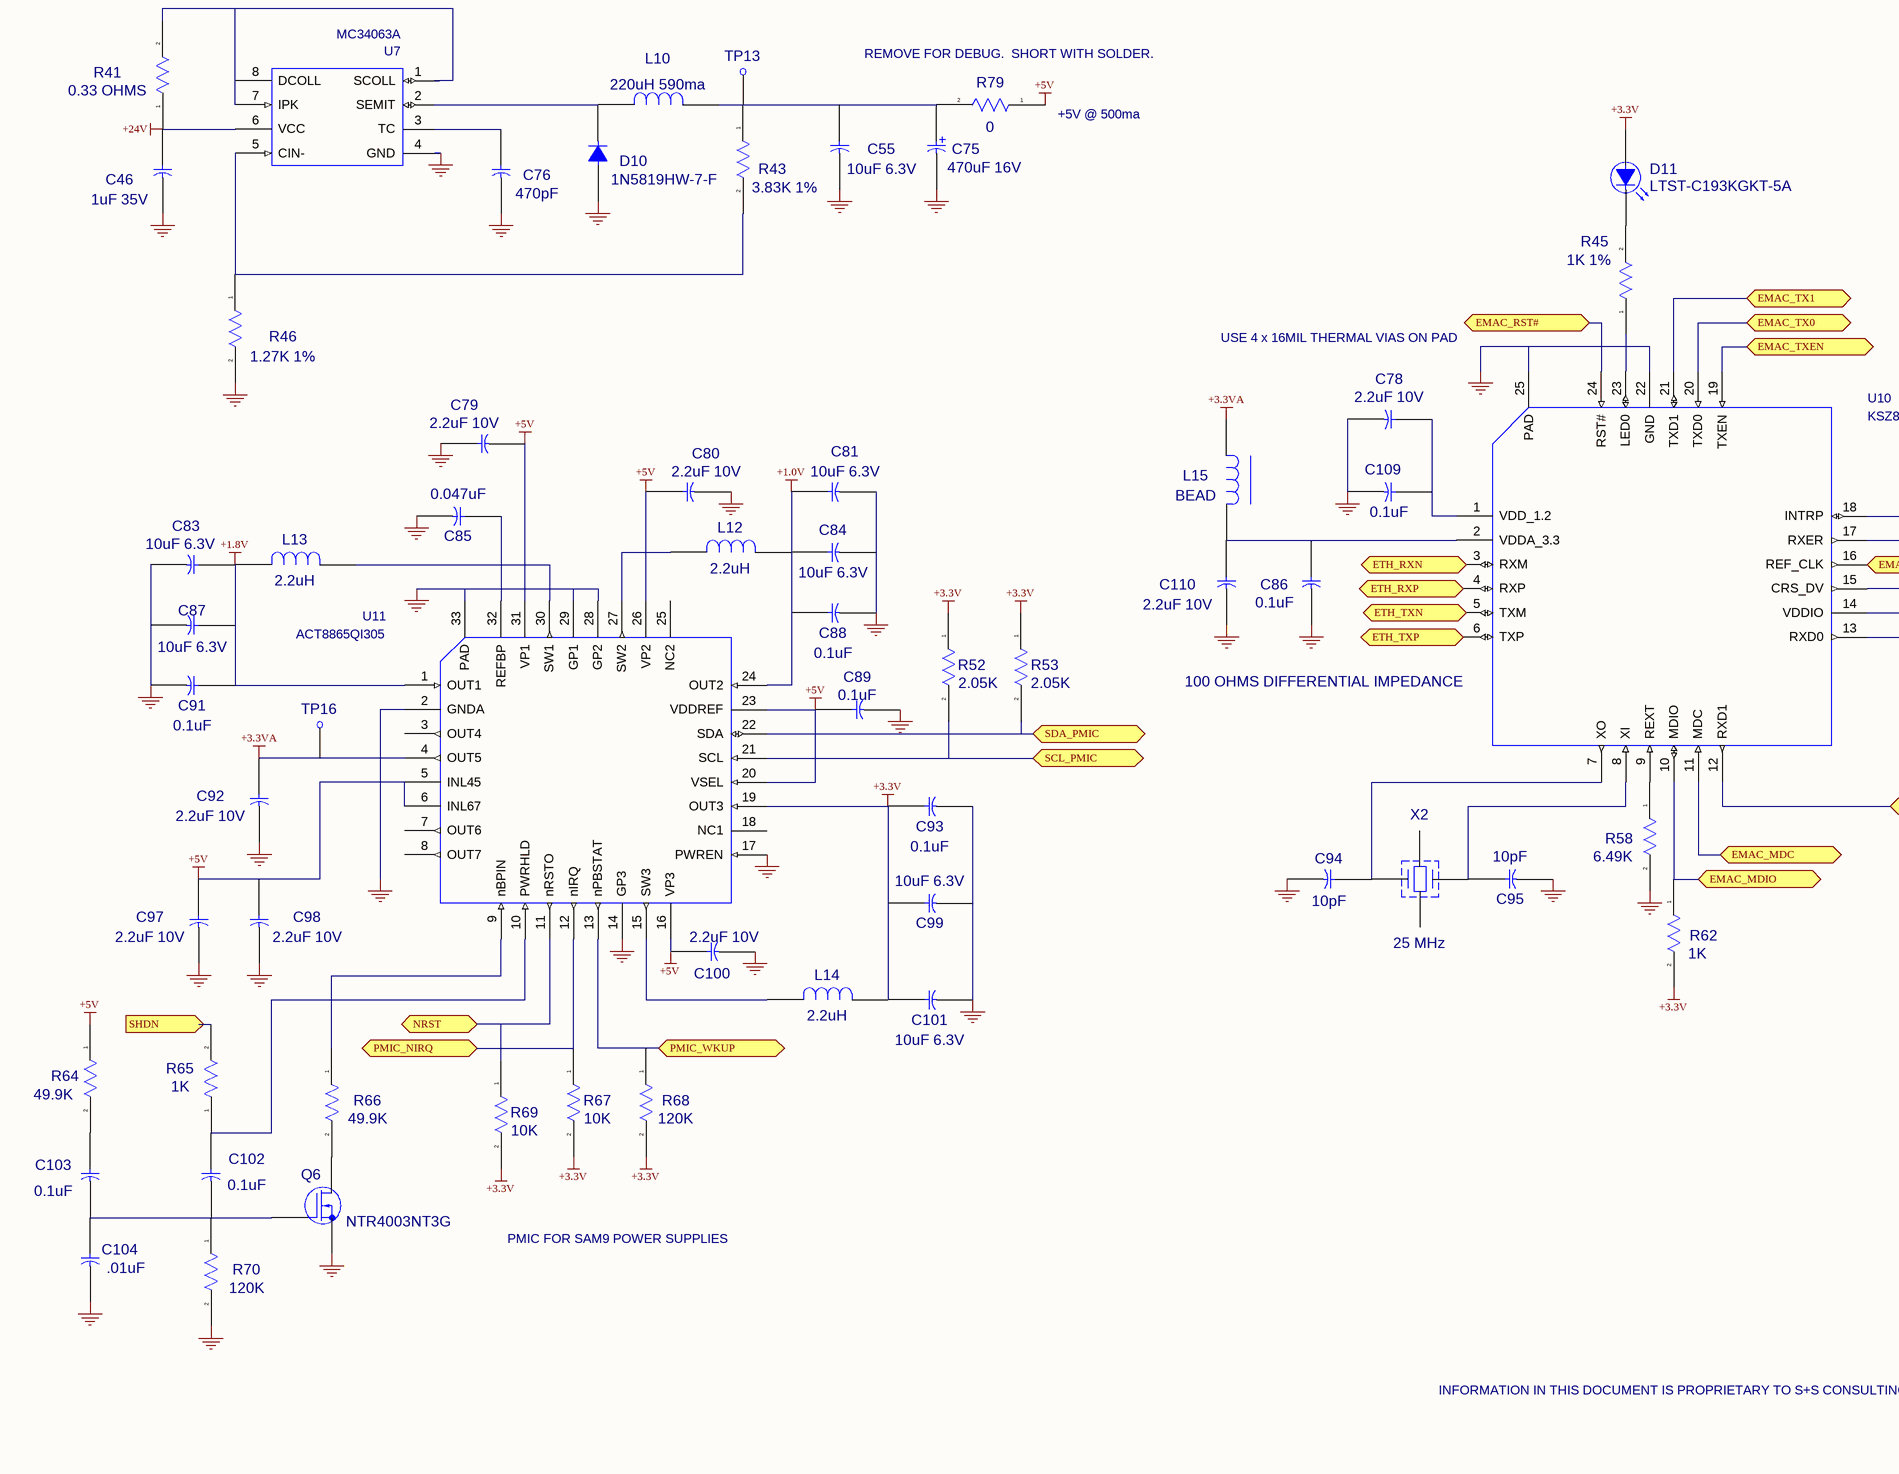
[diagram p4: rNET_POE_Sensor._Sheet2_RevA1.SchDoc, bottom left]
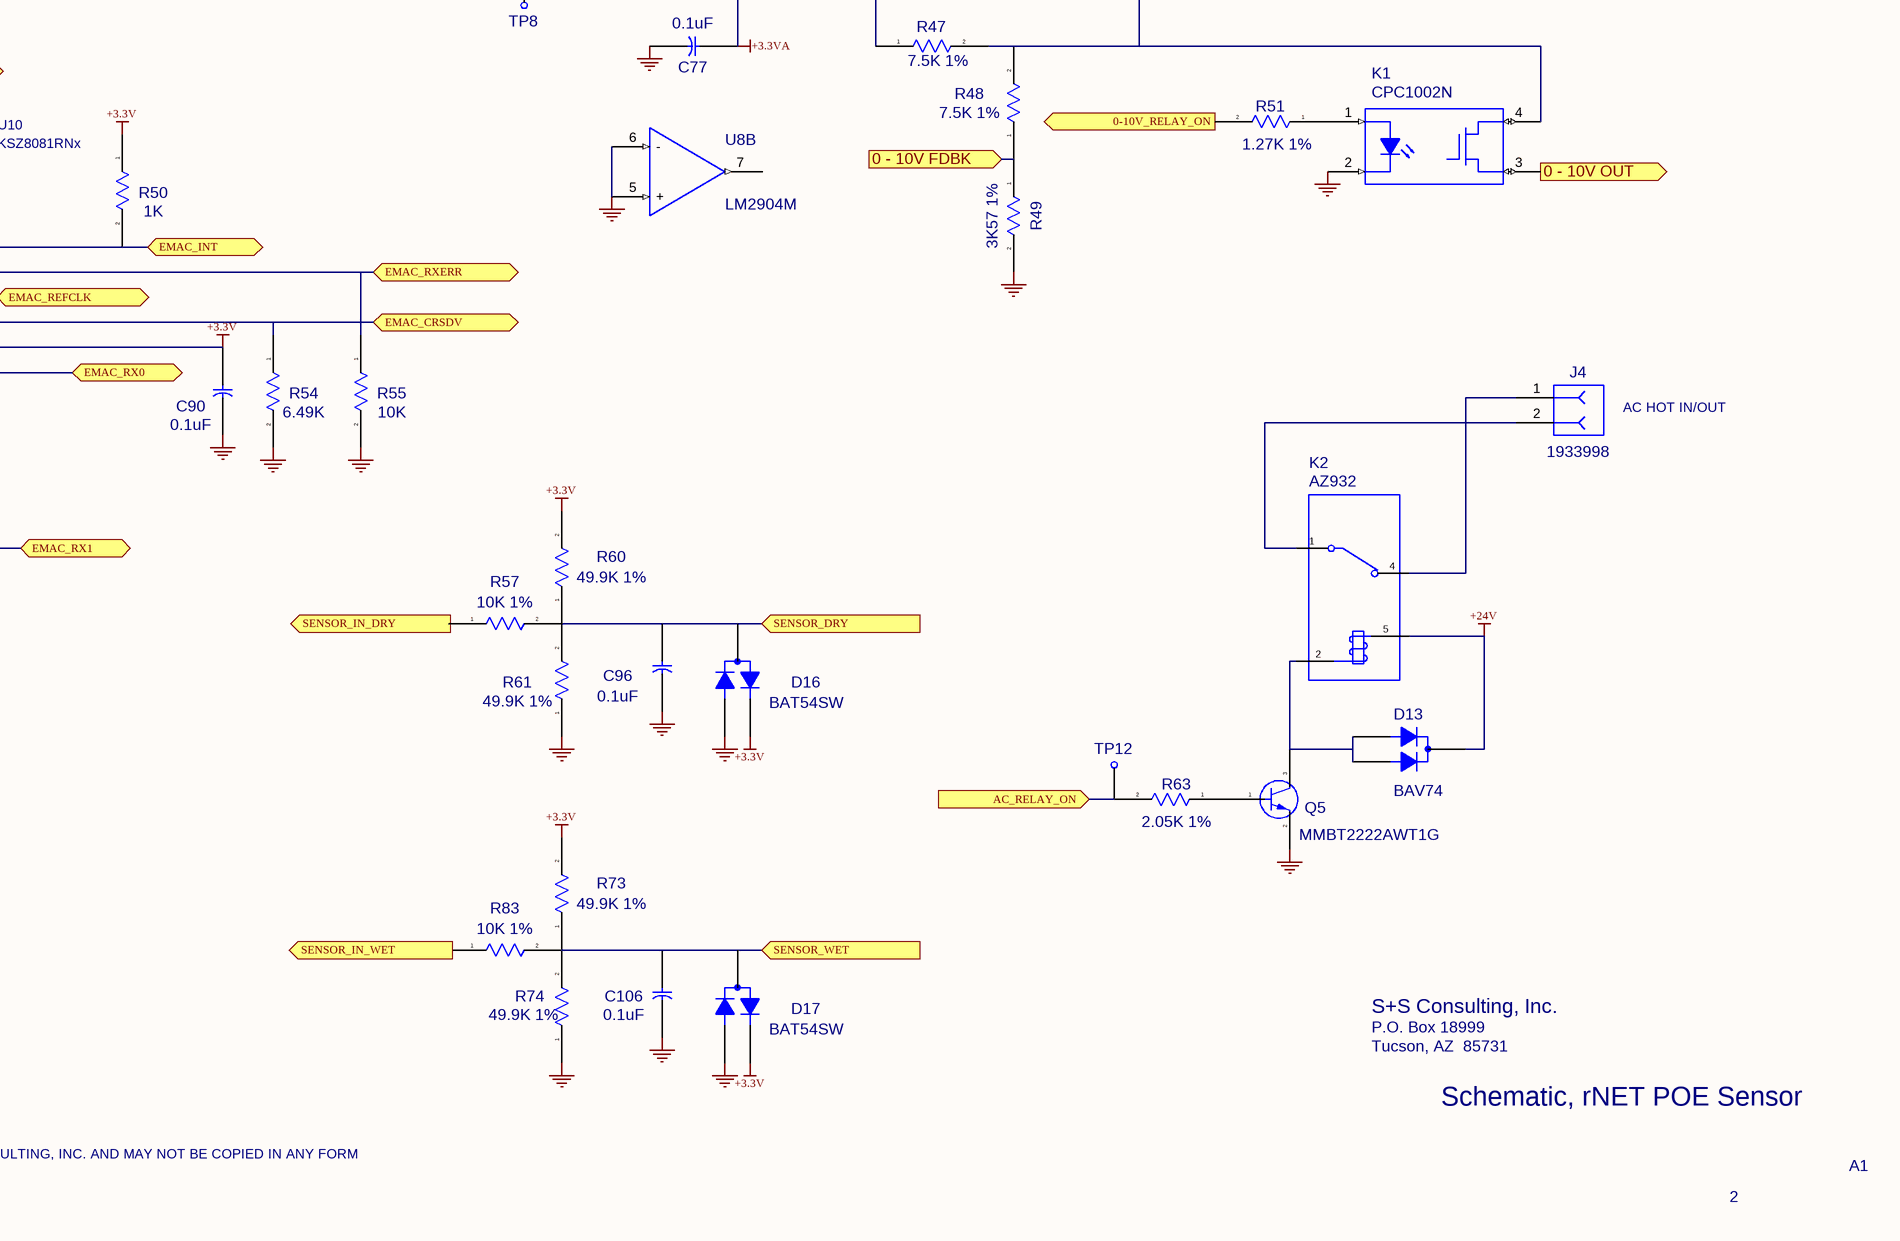
[diagram p5: rNET_POE_Sensor._Sheet2_RevA1.SchDoc, bottom right]

### Parts
C40  2200pF 2KV  [1210]  (value not drawn)
C46  1uF 35V  [0603LEAST]
C49  2200pF 2KV  [1210]
C50  680pF  [0603LEAST]
C51  0.1uF 100V  [0402NOM]
C52  1uF 100V  [1206]
C53  1uF 100V  [1206]
C54  10uF 35V  [1206]
C55  10uF 6.3V  [0402NOM]
C56  100uF 35V  [CAP_AL_SMD_8.3MM]
C57  1uF 100V  [1206]
C58  0.1uF  [0402NOM]
C59  10uF 35V  [1206]
C60  100pF  [0402NOM]
C61  .01uF  [0402NOM]
C62  .01uF  [0402NOM]
C63  .01uF  [0402NOM]
C64  .01uF  [0402NOM]
C65  1000pF 100V  [0603LEAST]
C66  22uF 100V  [CAP_AL_SMD_10.3MM]
C67  0.1uF 100V  [0402NOM]
C68  1000pF 100V  [0603LEAST]
C69  .01uF  [0402NOM]
C70  15nF  [0402NOM]
C71  0.1uF  [0402NOM]
C72  1uF 35V  [0603LEAST]
C73  1000pF 2KV  [1206]
C74  0.1uF 100V  [0402NOM]
C75  470uF 16V  [CAP_AL_SMD_8.3MM]
C76  470pF  [0402NOM]
C77  0.1uF  [0402NOM]
C78  2.2uF 10V  [0402NOM]
C79  2.2uF 10V  [0402NOM]
C80  2.2uF 10V  [0402NOM]
C81  10uF 6.3V  [0402NOM]
C82  0.1uF  [0402NOM]
C83  10uF 6.3V  [0402NOM]
C84  10uF 6.3V  [0402NOM]
C85  0.047uF  [0402NOM]
C86  0.1uF  [0402NOM]
C87  10uF 6.3V  [0402NOM]
C88  0.1uF  [0402NOM]
C89  0.1uF  [0402NOM]
C90  0.1uF  [0402NOM]
C91  0.1uF  [0402NOM]
C92  2.2uF 10V  [0402NOM]
C93  0.1uF  [0402NOM]
C94  10pF  [0402NOM]
C95  10pF  [0402NOM]
C96  0.1uF  [0402NOM]
C97  2.2uF 10V  [0402NOM]
C98  2.2uF 10V  [0402NOM]
C99  10uF 6.3V  [0402NOM]
C100  2.2uF 10V  [0402NOM]
C101  10uF 6.3V  [0402NOM]
C102  0.1uF  [0402NOM]
C103  0.1uF  [0402NOM]
C104  .01uF  [0402NOM]
C106  0.1uF  [0402NOM]
C107  0.1uF  [0402NOM]
C108  0.1uF  [0402NOM]
C109  0.1uF  [0402NOM]
C110  2.2uF 10V  [0402NOM]
D2  B540  [SMC1]
D3  MURA120  [SMAPWR]
D4  MURA120  [SMAPWR]
D5  BAV74  [SOT23-3]
D6  SMAJ58A  [SMAPWR]
D7  BAT54SW  [SC70]
D8  HD01-T  [SMD4-MINIDIP]
D9  HD01-T  [SMD4-MINIDIP]
D10  1N5819HW-7-F  [SMAEIA]
D11  LTST-C193KGKT-5A  [0603_POL]
D13  BAV74  [SOT23-3]
D14  CD143A-SR2.8  [SOT143]
D15  CD143A-SR2.8  [SOT143]
D16  BAT54SW  [SC70]
D17  BAT54SW  [SC70]
J2  SS-7188VS-A-FLS  [CONNVERTICALRJ45_SS-7188VS-A-FLS-SHIELDED]
J3  1984992  [TERMBLK1X5D3.5MMSPRING]
J4  1933998  [TERMBLK1X2X2D5MM_1933998]
K1  CPC1002N  [SOP4]
K2  AZ932  [AZ932FORMB]
L6  10uH 0.85A  [1008]
L8  FERRITE 220 OHM  [0603LEAST]
L9  FERRITE 200 OHM  [0603LEAST]
L10  220uH 590ma  [INDTAIYONRS6028]
L12  2.2uH  [INDTAIYONR2410T]
L13  2.2uH  [INDTAIYONR2410T]
L14  2.2uH  [INDTAIYONR2410T]
L15  BEAD  [0402NOM]
P2  HEADER1X2  [HEADER1X2]  (value not drawn)
Q1  FDS2582  [SOIC8]
Q2  DZT2222A-13  [SOT223]
Q5  MMBT2222AWT1G  [SOT323]
Q6  NTR4003NT3G  [SOT23-3]
R18  20  [1206]
R19  39K  [0603LEAST]
R20  120K  [0402NOM]
R21  10K  [0402NOM]
R22  120K  [0402NOM]
R23  49.9  [0402NOM]
R24  162K  [0402NOM]
R25  24.9K  [0402NOM]
R26  10K 1%  [0402NOM]
R27  49.9  [0402NOM]
R28  30.9K 1%  [0402NOM]
R29  3.83K  [0402NOM]
R30  1K  [0402NOM]
R31  0.39 OHMS  [1206]
R32  1.27K  [0402NOM]
R33  76.8  [0402NOM]
R34  76.8  [0402NOM]
R35  76.8  [0402NOM]
R36  76.8  [0402NOM]
R37  10K 1%  [0402NOM]
R38  2.05K  [0402NOM]
R39  301  [0402NOM]
R40  3.57K 1%  [0402NOM]
R41  0.33 OHMS  [0603LEAST]
R42  120 2W  [2512]
R43  3.83K 1%  [0402NOM]
R44  3K57 1%  [0402NOM]
R45  1K 1%  [0402NOM]
R46  1.27K 1%  [0402NOM]
R47  7.5K 1%  [0402NOM]
R48  7.5K 1%  [0402NOM]
R49  3K57 1%  [0402NOM]
R50  1K  [0402NOM]
R51  1.27K 1%  [0402NOM]
R52  2.05K  [0402NOM]
R53  2.05K  [0402NOM]
R54  6.49K  [0402NOM]
R55  10K  [0402NOM]
R57  10K 1%  [0402NOM]
R58  6.49K  [0402NOM]
R60  49.9K 1%  [0402NOM]
R61  49.9K 1%  [0402NOM]
R62  1K  [0402NOM]
R63  2.05K 1%  [0402NOM]
R64  49.9K  [0402NOM]
R65  1K  [0402NOM]
R66  49.9K  [0402NOM]
R67  10K  [0402NOM]
R68  120K  [0402NOM]
R69  10K  [0402NOM]
R70  120K  [0402NOM]
R73  49.9K 1%  [0402NOM]
R74  49.9K 1%  [0402NOM]
R75  3.3  [0402NOM]
R76  3.3  [0402NOM]
R77  3.3  [0402NOM]
R78  3.3  [0402NOM]
R79  0  [0402NOM]
R83  10K 1%  [0402NOM]
T1  POE13P-24L  [XFMR_POE13P]
T2  SM51108PEL  [XFMR WURTH 749013011]
TP5  +24V  [TESTPOINTTOPD25]  (value not drawn)
TP6  DAC SYNC  [TESTPOINTTOPD25]  (value not drawn)
TP7  SCLK  [TESTPOINTTOPD25]  (value not drawn)
TP8  SDO  [TESTPOINTTOPD25]  (value not drawn)
TP9  SENSOR  [TESTPOINTTOPD25]  (value not drawn)
TP10  0-10V  [TESTPOINTTOPD25]  (value not drawn)
TP11  GND  [TESTPOINTTOPD25]  (value not drawn)
TP12  AC RELAY  [TESTPOINTTOPD25]  (value not drawn)
TP13  +5V  [TESTPOINTTOPD25]  (value not drawn)
TP14  VIN  [TESTPOINTTOPD25]  (value not drawn)
TP15  PGND  [TESTPOINTTOPD25]  (value not drawn)
TP16  +3.3VA  [TESTPOINTTOPD25]  (value not drawn)
TP17  MOUNTING  [TESTPOINT250D130]  (value not drawn)
TP18  MOUNTING  [TESTPOINT250D130]  (value not drawn)
TP19  MOUNTING  [TESTPOINT250D130]  (value not drawn)
TP20  MOUNTING  [TESTPOINT250D130]  (value not drawn)
TP21  SENSOR_L  [TESTPOINTTOPD25]  (value not drawn)
U4  TPS23753APW  [TSSOP14]
U5  TCMT1107  [SSOP4]
U6  TL431BIDCK  [SC70-6]
U7  MC34063A  [SOIC8N]
U8  LM2904M  [SOIC8N]  (parts A,B of 2)
U9  DAC5311IDCKR  [SC70-6]
U10  KSZ8081RNx  [QFN24]
U11  ACT8865QI305  [TQFN44-32]
X2  25 MHz  [XTALXRCGB]

### Ports
0 - 10V FDBK (out), 0 - 10V OUT (in), 0 - 10V OUT (out), 0-10V_RELAY_ON (in), AC_RELAY_ON (in), DAC SYNC (in), EMAC_CRSDV (bidir), EMAC_INT (bidir), EMAC_MDC (bidir), EMAC_MDIO (bidir), EMAC_REFCLK (bidir), EMAC_RST# (bidir), EMAC_RX0 (bidir), EMAC_RX1 (bidir), EMAC_RXERR (bidir), EMAC_TX0 (bidir), EMAC_TX1 (bidir), EMAC_TXEN (bidir), ETH_RXN (bidir), ETH_RXP (bidir), ETH_TXN (bidir), ETH_TXP (bidir), NRST (bidir), PMIC_NIRQ (bidir), PMIC_WKUP (bidir), SCL_PMIC (bidir), SCLK (in), SDA_PMIC (bidir), SDO (in), SENSOR_DRY (out), SENSOR_IN_DRY (in), SENSOR_IN_DRY (out), SENSOR_IN_WET (in), SENSOR_IN_WET (out), SENSOR_WET (out), SHDN (in)

### Nets
+1.0V: C81.2 C84.2 C88.2 L12.1 U11.24(OUT2)
+1.8V: C83.2 C87.2 C91.2 L13.2 U11.1(OUT1)
+3.3V: C90.2 C93.2 C99.2 C101.2 D11.2(A) D14.4(VDD) D15.4(VDD) D16.2(C) D17.2(C) L14.1 R50.1 R52.1 R53.1 R60.2 R62.2 R67.2 R68.2 R69.2 R73.2 U10.14(VDDIO) U11.19(OUT3)
+3.3VA: C77.2 C92.2 L15.2 TP16.1 U9.4(AVDD/VR) U11.4(OUT5)
+5V: C79.1 C80.2 C89.2 C97.2 C98.2 C100.2 R64.1 R79.1 U11.5(INL45) U11.6(INL67) U11.16(VP3) U11.20(VSEL) U11.23(VDDREF) U11.26(VP2) U11.31(VP1)
+24V: C46.2 C54.2 C56.2 C57.2 C74.2 D2.2(C) D7.2(C) D13.3(C) J3.1 K2.5 R18.2 R26.1 R28.1 R29.1 R41.1 R42.1 TP5.1 U7.6(VCC) U8.8(V+)
CHASSIS: C40.2 C73.1 J2.11(SHLD) J2.12(SHLD) TP17.1
GND: C40.1 C46.1 C49.1 C54.1 C55.1 C56.1 C57.1 C72.1 C74.1 C75.1 C76.1 C77.1 C78.1 C79.2 C80.1 C81.1 C82.1 C83.1 C84.1 C85.1 C86.1 C87.1 C88.1 C89.1 C90.1 C91.1 C92.1 C93.1 C94.1 C95.1 C96.1 C97.1 C98.1 C99.1 C100.1 C101.1 C104.1 C106.1 C108.1 C109.1 C110.1 D10.1(A) D14.1(GND) D15.1(GND) D16.1(A) D17.1(A) J3.5 K1.2(CATH) Q5.2(Emitter) Q6.2(S) R40.2 R44.2 R46.2 R49.2 R54.2 R55.2 R58.2 R61.1 R70.2 R74.1 T1.7(SEC+) T1.8(SEC+) TP11.1 U6.6(A) U7.4(GND) U8.4(GND) U8.5(+) U8.6(-) U9.5(GND) U10.22(GND) U10.25(PAD) U11.2(GNDA) U11.14(GP3) U11.17(PWREN) U11.28(GP2) U11.29(GP1) U11.33(PAD)
PGND: C49.2 C52.1 C53.1 C58.1 C59.1 C66.1 C71.1 C107.1 P2.2 R21.2 R22.2 R24.2 R31.1 T1.2(BIAS+) U4.6(RTN) U5.3(EMIT)
0 - 10V FDBK: R48.1 R49.1 ; port 0 - 10V FDBK
0 - 10V OUT: J3.3 K1.3(DRAIN) TP10.1 ; port 0 - 10V OUT
0-10V_RELAY_ON: R51.2 ; port 0-10V_RELAY_ON
AC_RELAY_ON: R63.2 TP12.1 ; port AC_RELAY_ON
DAC SYNC: TP6.1 U9.1(SYNC#) ; port DAC SYNC
EMAC_CRSDV: R54.1 U10.15(CRS_DV) ; port EMAC_CRSDV
EMAC_INT: R50.2 U10.18(INTRP) ; port EMAC_INT
EMAC_MDC: U10.11(MDC) ; port EMAC_MDC
EMAC_MDIO: R62.1 U10.10(MDIO) ; port EMAC_MDIO
EMAC_REFCLK: U10.16(REF_CLK) ; port EMAC_REFCLK
EMAC_RST#: U10.24(RST#) ; port EMAC_RST#
EMAC_RX0: U10.13(RXD0) ; port EMAC_RX0
EMAC_RX1: U10.12(RXD1) ; port EMAC_RX1
EMAC_RXERR: R55.1 U10.17(RXER) ; port EMAC_RXERR
EMAC_TX0: U10.20(TXD0) ; port EMAC_TX0
EMAC_TX1: U10.21(TXD1) ; port EMAC_TX1
EMAC_TXEN: U10.19(TXEN) ; port EMAC_TXEN
ETH_RXN: D15.2(I/O) R78.1 ; port ETH_RXN
ETH_RXP: D15.3(I/O) R77.1 ; port ETH_RXP
ETH_TXN: D14.2(I/O) R76.1 ; port ETH_TXN
ETH_TXP: D14.3(I/O) R75.1 ; port ETH_TXP
NRST: R69.1 U11.11(nRSTO) ; port NRST
PMIC_NIRQ: R67.1 U11.12(nIRQ) ; port PMIC_NIRQ
PMIC_WKUP: R68.1 U11.13(nPBSTAT) ; port PMIC_WKUP
SCL_PMIC: R52.2 U11.21(SCL) ; port SCL_PMIC
SCLK: TP7.1 U9.2(SCLK) ; port SCLK
SDA_PMIC: R53.2 U11.22(SDA) ; port SDA_PMIC
SDO: TP8.1 U9.3(DIN) ; port SDO
SENSOR_DRY: C96.2 D16.3(AC) R57.2 R60.1 R61.2 ; port SENSOR_DRY
SENSOR_IN_DRY: J3.4 TP21.1 ; port SENSOR_IN_DRY
SENSOR_IN_WET: J3.2 TP9.1 ; port SENSOR_IN_WET
SENSOR_WET: C106.2 D17.3(AC) R73.1 R74.2 R83.2 ; port SENSOR_WET
SHDN: R65.2 ; port SHDN
NetC50_1: C50.1 D2.1(A) T1.9(SEC-) T1.10(SEC-)
NetC50_2: C50.2 R18.1
NetC51_1: C51.1 D3.2(C) R19.1
NetC51_2: C51.2 C52.2 C53.2 L6.1 R19.2 T1.3(PRI+)
NetC55_2: C55.2 C75.2 L10.1 R43.1 R79.2 TP13.1
NetC58_2: C58.2 C59.2 C107.2 D5.3(C) U4.4(VC)
NetC60_1: C60.1 C69.1 R28.2 R40.1 U6.3(REF)
NetC60_2: C60.2 D7.1(A) R37.2 U5.2(CATH) U6.1(C)
NetC61_1: C61.1 R33.2
NetC61_2: C61.2 D9.4(AC) T2.10(TXCT)
NetC62_1: C62.1 R34.2
NetC62_2: C62.2 D9.3(AC) T2.15(RXCT)
NetC63_1: C63.1 R35.2
NetC63_2: C63.2 D8.4(AC) J2.4(A-) J2.5(A+)
NetC64_1: C64.1 R36.2
NetC64_2: C64.2 D8.3(AC) J2.7(B+) J2.8(B-)
NetC65_1: C65.1 C67.1 D6.1(A) L9.1 R32.2 TP15.1 U4.7(VSS)
NetC65_2: C65.2 C66.2 C67.2 D4.2(C) D6.2(C) L6.2 L8.1 R25.2 TP14.1 U4.8(VDD1) U4.9(VDD)
NetC68_1: C68.1 D8.2(-) D9.2(-) L9.2
NetC68_2: C68.2 D8.1(+) D9.1(+) L8.2
NetC69_2: C69.2 R37.1
NetC70_1: C70.1 R39.1
NetC70_2: C70.2 R38.1 U4.1(CTL) U5.4(COL)
NetC71_2: C71.2 R38.2 R39.2 U4.2(VB)
NetC72_2: C72.2 D7.3(AC) R26.2
NetC73_2: C73.2 R33.1 R34.1 R35.1 R36.1
NetC76_2: C76.2 U7.3(TC)
NetC78_2: C78.2 C109.2 U10.1(VDD_1.2)
NetC82_2: C82.2 T2.7(TCT)
NetC85_2: C85.2 U11.32(REFBP)
NetC86_2: C86.2 C110.2 L15.1 U10.2(VDDA_3.3)
NetC94_2: C94.2 U10.7(XO) X2.1
NetC95_2: C95.2 U10.8(XI) X2.3
NetC102_1: C102.1 C103.1 C104.2 Q6.1(G) R70.1
NetC102_2: C102.2 R65.1 U11.10(PWRHLD)
NetC103_2: C103.2 R64.2
NetC108_2: C108.2 T2.2(RCT)
NetD3_1: D3.1(A) Q1.5(D) Q1.6(D) Q1.7(D) Q1.8(D) T1.4(PRI-)
NetD4_1: D4.1(A) P2.1 R20.1
NetD5_1: D5.1(A) D5.2(A) R23.2
NetD10_2: D10.2(C) L10.2 U7.2(SEMIT)
NetD11_1: D11.1(C) R45.2
NetD13_1: D13.1(A) D13.2(A) K2.2 Q5.3(Collector)
NetJ2_1: J2.1(TX+) T2.16(RX+)
NetJ2_2: J2.2(TX-) T2.14(RX-)
NetJ2_3: J2.3(RX+) T2.11(TX+)
NetJ2_6: J2.6(RX-) T2.9(TX-)
NetJ4_1: J4.1 J4.3 K2.4
NetJ4_2: J4.2 J4.4 K2.1
NetK1_1: K1.1(ANODE) R51.1
NetK1_4: K1.4(DRAIN) Q2.3(E) R47.2 R48.2
NetL12_2: L12.2 U11.27(SW2)
NetL13_1: L13.1 U11.30(SW1)
NetL14_2: L14.2 U11.15(SW3)
NetQ1_1: Q1.1(S) Q1.2(S) Q1.3(S) R30.1 R31.2
NetQ1_4: Q1.4(G) R27.1
NetQ2_1: Q2.1(B) U8.1(OUT)
NetQ2_2: Q2.2(C) Q2.4(C) R42.2
NetQ5_1: Q5.1(Base) R63.1
NetQ6_3: Q6.3(D) R66.2
NetR20_2: R20.2 R21.1 U4.12(APD)
NetR22_1: R22.1 U4.14(FRS)
NetR23_1: R23.1 T1.1(BIAS-)
NetR24_1: R24.1 U4.13(BLNK)
NetR25_1: R25.1 U4.10(DEN)
NetR27_2: R27.2 U4.5(GATE)
NetR29_2: R29.2 U5.1(ANODE)
NetR30_2: R30.2 U4.3(CS)
NetR32_1: R32.1 U4.11(CLS)
NetR41_2: R41.2 U7.1(SCOLL) U7.7(IPK) U7.8(DCOLL)
NetR43_2: R43.2 R46.1 U7.5(CIN-)
NetR44_1: R44.1 R47.1 U8.2(-)
NetR45_1: R45.1 U10.23(LED0)
NetR58_1: R58.1 U10.9(REXT)
NetR66_1: R66.1 U11.9(nBPIN)
NetR75_2: R75.2 T2.1(RD+)
NetR76_2: R76.2 T2.3(RD-)
NetR77_2: R77.2 T2.6(TD+)
NetR78_2: R78.2 T2.8(TD-)
NetU8_3: U8.3(+) U9.6(VO)

Not connected (* = marked no-connect by the designer): J2 9(NC) 10(NC) 13 14; J3 9 10 11 12; J4 9 10 11 12; R57 1; R83 1; TP18 1; TP19 1; TP20 1; U6 2(NC) 4(NC) 5(NC); U8 7(OUT); U10 3(RXM) 4(RXP) 5(TXM) 6(TXP); U11 3(OUT4) 7(OUT6) 8(OUT7) 18(NC1) 25(NC2); X2 2 4

### Notes on the sheet
- 100 OHMS DIFFERENTIAL IMPEDANCE TX+/- AND RX+/-
- (near P2) 28 - 57VDC FOR TEST
- (near R22) 125KHz
- (near R32) CLASS 0
- (near R32) (CLASS 3 90.9 OHMS)
- (near TP20) MOUNTING HOLES
- 802.3AF CLASS 0 COMPLIANT POWER SUPPLY
- LOCATE CLOSE TO C56/C57 SO C56/C57 DOUBLE AS BYPASS
- (near R79) REMOVE FOR DEBUG.  SHORT WITH SOLDER.
- FOR DIMMING CONTROL OPERATION (NO +24VDC SENSOR) COULD USE +12VDC INSTEAD OF +24VDC
- CHANGE T1, K2, R28 and R42 FOR +12VDC
- +5V @ 500ma
- USE 4 x 16MIL THERMAL VIAS ON PAD
- 100 OHMS DIFFERENTIAL IMPEDANCE
- AC HOT IN/OUT
- PMIC FOR SAM9 POWER SUPPLIES
- S+S Consulting, Inc.
- P.O. Box 18999
- Tucson, AZ  85731
- Schematic, rNET POE Sensor
- INFORMATION IN THIS DOCUMENT IS PROPRIETARY TO S+S CONSULTING, INC. AND MAY NOT BE COPIED IN ANY FORM
- 2
- A1

### Library data of the parts
C40 C49 = CCAP1210: Value: {Value}; Part Number: CCAP1210
C46 C50 C65 C68 C72 = CCAP0603L: Value: {Value}; Part Number: CCAP0603L
C51 C55 C58 C60-C64 C67 C69-C71 C74 C76-C104 C106-C110 = CCAP0402: Value: {Value}; Part Number: CCAP0402
C52-C54 C57 C59 C73 = CCAP1206: Value: {Value}; Part Number: CCAP1206
C56 C75 = CAP_AL_SMD_8.3MM: Value: {Value}; Part Number: CAP_AL_SMD_8.3MM
C66 = CAP_AL_SMD_10.3MM: Value: {Value}; Part Number: CAP_AL_SMD_10.3MM
D2 = DIODESMC1: Value: {Value}; Part Number: DIODESMC1
D3 D4 = DIODESMAPWR: Value: {Value}; Part Number: DIODESMAPWR
D5 D13 = BBAV74ZX: Part Number: BBAV74ZX; Value: *
D6 = ZZENERSMAPWR: Value: {Value}; Part Number: ZZENERSMAPWR
D7 D16 D17 = BBAT54SC70: Part Number: BBAT54SC70; Value: *
D8 D9 = HD01-T: Value: {Value}; Part Number: HD01-T
D10 = DIODESMAEIA: Value: {Value}; Part Number: DIODESMAEIA
D11 = LED_0603_C1A2: Value: {Value}; Part Number: LED_0603_C1A2
D14 D15 = CD143A-SR2.8: Value: {Value}; Part Number: CD143A-SR2.8
J2 = CONNVERTICALRJ45_SS-7188VS-A-FLS-SHIELDED: Value: {Value}; Part Number: CONNVERTICALRJ45_SS-7188VS-A-FLS-SHIELDED
J3 = TERMBLK1X5D3.5MMSPRING: Part Number: TERMBLK1X5D3.5MMSPRING; Value: *
J4 = TERMBLK1X2X2D5MM_1933998: Part Number: TERMBLK1X2X2D5MM_1933998; Value: *
K2 = AZ932FORMB: Part Number: AZ932FORMB; Value: *
L6 = IND1008: Value: {Value}; Part Number: IND1008
L8 L9 = FERRITE0603L: Value: {Value}; Part Number: FERRITE0603L
L10 = INDTAIYONRS6028: Value: {Value}; Part Number: INDTAIYONRS6028
L12-L14 = INDTAIYONR2410T: Value: {Value}; Part Number: INDTAIYONR2410T
L15 = FERRITE0402: Value: {Value}; Part Number: FERRITE0402
Q1 = SI4386DY: Value: {Value}; Part Number: SI4386DY
Q2 = FZT2222A: Value: {Value}; Part Number: FZT2222A
Q5 = NPNSOT323: Value: {Value}; Part Number: NPNSOT323
Q6 = FETNSOT23: Value: {Value}; Part Number: FETNSOT23
R18 R31 = RRES1206: Value: {Value}; Part Number: RRES1206
R19 R41 = RRES0603L: Value: {Value}; Part Number: RRES0603L
R20-R30 R32-R40 R43-R55 R57 R58 R60-R70 R73-R79 R83 = RRES0402: Value: {Value}; Part Number: RRES0402
R42 = RRES2512: Value: {Value}; Part Number: RRES2512
T1 = XFMR_POE13P: Value: {Value}; Part Number: XFMR_POE13P
T2 = XFMR WURTH 749013011: Value: {Value}; Part Number: XFMR WURTH 749013011
TP5-TP16 TP21 = TESTPOINTTOPD25: Part Number: TESTPOINTTOPD25; Value: *
TP17-TP20 = TESTPOINT250D130: Part Number: TESTPOINT250D130; Value: *
U7 = MC3x063A: Part Number: MC3x063A; Value: *
U8 = LM2904M_N: Low Power Dual OPERATIONAL AMPLIFIER; Part Number: LM2904M_N; Value: *
U9 = DACx311IDCKR: Part Number: DACx311IDCKR; Value: *
U10 = KXA8081RNx: Part Number: KXA8081RNx; Value: *
U11 = ACT8865QIx05: Part Number: ACT8865QIx05; Value: *
X2 = XTALXRCGB: Value: {Value}; Part Number: XTALXRCGB
K1 = CPC1002N: Part Number: CPC1002N; Value: *
P2 = HEADER1X2: Part Number: HEADER1X2; Value: *
U4 = TPS23753APW: Part Number: TPS23753APW; Value: *
U5 = TCMT1107: Part Number: TCMT1107; Value: *
U6 = TL431BIDCK: Part Number: TL431BIDCK; Value: *

## Nets that join several sheets
+1.0V: rNET_POE_Sensor._Sheet1_RevA1 (8 pins), rNET_POE_Sensor._Sheet2_RevA1 (5 pins)
+1.8V: rNET_POE_Sensor._Sheet1_RevA1 (41 pins), rNET_POE_Sensor._Sheet2_RevA1 (5 pins)
+3.3V: rNET_POE_Sensor._Sheet1_RevA1 (16 pins), rNET_POE_Sensor._Sheet2_RevA1 (21 pins)
+3.3VA: rNET_POE_Sensor._Sheet1_RevA1 (C14.2 C43.2 U1.A4 U1.C6), rNET_POE_Sensor._Sheet2_RevA1 (6 pins)
+5V: rNET_POE_Sensor._Sheet1_RevA1 (D12.2), rNET_POE_Sensor._Sheet2_RevA1 (15 pins)
+24V: rNET_POE_Sensor._Sheet1_RevA1 (R16.2), rNET_POE_Sensor._Sheet2_RevA1 (19 pins)
GND: rNET_POE_Sensor._Sheet1_RevA1 (90 pins), rNET_POE_Sensor._Sheet2_RevA1 (77 pins)
0 - 10V FDBK: rNET_POE_Sensor._Sheet1_RevA1 (U1.C4), rNET_POE_Sensor._Sheet2_RevA1 (R48.1 R49.1)
0-10V_RELAY_ON: rNET_POE_Sensor._Sheet1_RevA1 (U1.B4), rNET_POE_Sensor._Sheet2_RevA1 (R51.2)
AC_RELAY_ON: rNET_POE_Sensor._Sheet1_RevA1 (U1.A2), rNET_POE_Sensor._Sheet2_RevA1 (R63.2 TP12.1)
DAC SYNC: rNET_POE_Sensor._Sheet1_RevA1 (U1.T7), rNET_POE_Sensor._Sheet2_RevA1 (TP6.1 U9.1)
EMAC_CRSDV: rNET_POE_Sensor._Sheet1_RevA1 (U1.E4), rNET_POE_Sensor._Sheet2_RevA1 (R54.1 U10.15)
EMAC_INT: rNET_POE_Sensor._Sheet1_RevA1 (U1.D5), rNET_POE_Sensor._Sheet2_RevA1 (R50.2 U10.18)
EMAC_MDC: rNET_POE_Sensor._Sheet1_RevA1 (U1.B3), rNET_POE_Sensor._Sheet2_RevA1 (U10.11)
EMAC_MDIO: rNET_POE_Sensor._Sheet1_RevA1 (U1.E3), rNET_POE_Sensor._Sheet2_RevA1 (R62.1 U10.10)
EMAC_REFCLK: rNET_POE_Sensor._Sheet1_RevA1 (U1.D1), rNET_POE_Sensor._Sheet2_RevA1 (U10.16)
EMAC_RST#: rNET_POE_Sensor._Sheet1_RevA1 (U1.C5), rNET_POE_Sensor._Sheet2_RevA1 (U10.24)
EMAC_RX0: rNET_POE_Sensor._Sheet1_RevA1 (U1.D3), rNET_POE_Sensor._Sheet2_RevA1 (U10.13)
EMAC_RX1: rNET_POE_Sensor._Sheet1_RevA1 (U1.D4), rNET_POE_Sensor._Sheet2_RevA1 (U10.12)
EMAC_RXERR: rNET_POE_Sensor._Sheet1_RevA1 (U1.D2), rNET_POE_Sensor._Sheet2_RevA1 (R55.1 U10.17)
EMAC_TX0: rNET_POE_Sensor._Sheet1_RevA1 (U1.C1), rNET_POE_Sensor._Sheet2_RevA1 (U10.20)
EMAC_TX1: rNET_POE_Sensor._Sheet1_RevA1 (U1.B2), rNET_POE_Sensor._Sheet2_RevA1 (U10.21)
EMAC_TXEN: rNET_POE_Sensor._Sheet1_RevA1 (U1.C2), rNET_POE_Sensor._Sheet2_RevA1 (U10.19)
NRST: rNET_POE_Sensor._Sheet1_RevA1 (P1.8 U1.P10), rNET_POE_Sensor._Sheet2_RevA1 (R69.1 U11.11)
PMIC_NIRQ: rNET_POE_Sensor._Sheet1_RevA1 (U1.R9), rNET_POE_Sensor._Sheet2_RevA1 (R67.1 U11.12)
PMIC_WKUP: rNET_POE_Sensor._Sheet1_RevA1 (U1.A7), rNET_POE_Sensor._Sheet2_RevA1 (R68.1 U11.13)
SCL_PMIC: rNET_POE_Sensor._Sheet1_RevA1 (U1.U9), rNET_POE_Sensor._Sheet2_RevA1 (R52.2 U11.21)
SCLK: rNET_POE_Sensor._Sheet1_RevA1 (U1.U7), rNET_POE_Sensor._Sheet2_RevA1 (TP7.1 U9.2)
SDA_PMIC: rNET_POE_Sensor._Sheet1_RevA1 (U1.R8), rNET_POE_Sensor._Sheet2_RevA1 (R53.2 U11.22)
SDO: rNET_POE_Sensor._Sheet1_RevA1 (U1.R6), rNET_POE_Sensor._Sheet2_RevA1 (TP8.1 U9.3)
SENSOR_DRY: rNET_POE_Sensor._Sheet1_RevA1 (U1.A1), rNET_POE_Sensor._Sheet2_RevA1 (5 pins)
SENSOR_WET: rNET_POE_Sensor._Sheet1_RevA1 (U1.C3), rNET_POE_Sensor._Sheet2_RevA1 (5 pins)
SHDN: rNET_POE_Sensor._Sheet1_RevA1 (U1.D8), rNET_POE_Sensor._Sheet2_RevA1 (R65.2)